# EAGLE design MotorController (EAGLE 5.10)

## Sheet 1 of 3
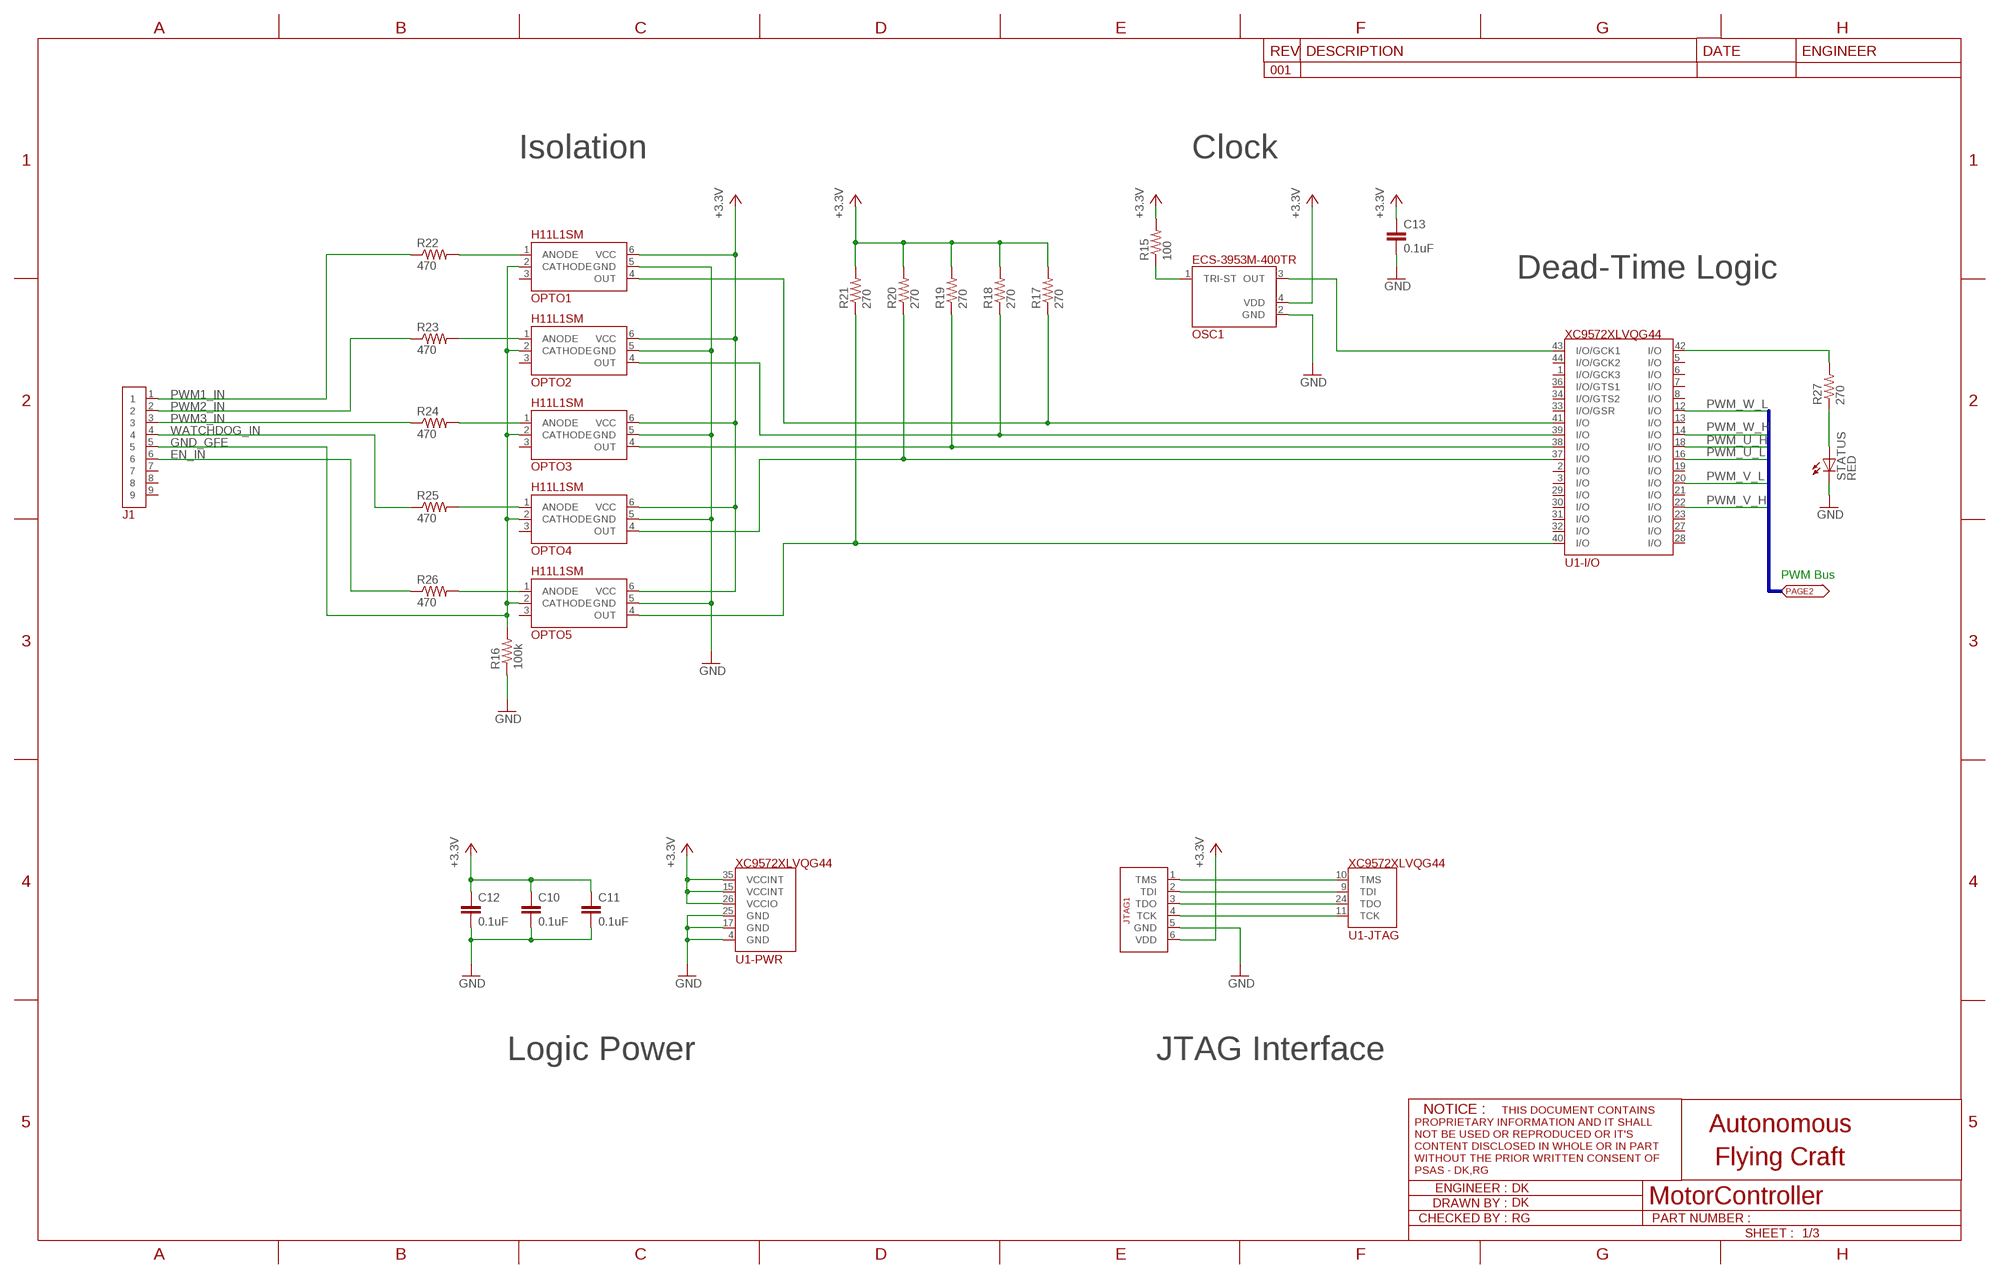
[diagram p0: schematic, sheet 1]

### Parts
C10  0.1uF  C-EUC0603  [C0603]
C11  0.1uF  C-EUC0603  [C0603]
C12  0.1uF  C-EUC0603  [C0603]
C13  0.1uF  C-EUC0603  [C0603]
J1  190-009-263-R001190  [190]
JTAG1  JTAG-FPGASMT  [HEADER6-SMT]
OPTO1  H11L1SM  [DIL6-SMD]
OPTO2  H11L1SM  [DIL6-SMD]
OPTO3  H11L1SM  [DIL6-SMD]
OPTO4  H11L1SM  [DIL6-SMD]
OPTO5  H11L1SM  [DIL6-SMD]
OSC1  ECS-3953M-400TR  [4-SMD]
R15  100  R-US_R0805  [R0805]
R16  100k  R-US_R0805  [R0805]
R17  270  R-US_R0805  [R0805]
R18  270  R-US_R0805  [R0805]
R19  270  R-US_R0805  [R0805]
R20  270  R-US_R0805  [R0805]
R21  270  R-US_R0805  [R0805]
R22  470  R-US_R0402  [R0402]
R23  470  R-US_R0402  [R0402]
R24  470  R-US_R0402  [R0402]
R25  470  R-US_R0402  [R0402]
R26  470  R-US_R0402  [R0402]
R27  270  R-US_R0805  [R0805]
STATUS  RED  LEDSMT1206  [1206]
U1  XC9572XLVQG44  [VQFP44]

### Nets
+3.3V: C10.1 C11.1 C12.1 C13.1 JTAG1.6(VDD) OPTO1.6(VCC) OPTO2.6(VCC) OPTO3.6(VCC) OPTO4.6(VCC) OPTO5.6(VCC) OSC1.4(VDD) R15.2 R17.2 R18.2 R19.2 R20.2 R21.2 U1.15(-PWR:VCCINT) U1.26(-PWR:VCCIO) U1.35(-PWR:VCCINT) ; also sheet 3
EN_IN: J1.6 R26.1
ENABLE: OPTO5.4(OUT) R21.1 U1.40(-I/O:I/O)
GND: C10.2 C11.2 C12.2 C13.2 JTAG1.5(GND) OPTO1.5(GND) OPTO2.5(GND) OPTO3.5(GND) OPTO4.5(GND) OPTO5.5(GND) OSC1.2(GND) R16.1 STATUS.C U1.4(-PWR:GND) U1.17(-PWR:GND) U1.25(-PWR:GND) ; also sheet 2,3
GND_GFE: J1.5 OPTO1.2(CATHODE) OPTO2.2(CATHODE) OPTO3.2(CATHODE) OPTO4.2(CATHODE) OPTO5.2(CATHODE) R16.2
N$6: JTAG1.1(TMS) U1.10(-JTAG:TMS)
N$12: OPTO1.1(ANODE) R22.2
N$23: OPTO2.1(ANODE) R23.2
N$44: OPTO3.1(ANODE) R24.2
N$45: OPTO4.1(ANODE) R25.2
N$48: OPTO5.1(ANODE) R26.2
N$49: R27.1 STATUS.A
N$50: R27.2 U1.42(-I/O:I/O)
N$59: JTAG1.2(TDI) U1.9(-JTAG:TDI)
N$60: JTAG1.3(TDO) U1.24(-JTAG:TDO)
N$61: JTAG1.4(TCK) U1.11(-JTAG:TCK)
N$65: OSC1.1(TRI-ST) R15.1
N$72: OSC1.3(OUT) U1.43(-I/O:I/O/GCK1)
PWM1_IN: J1.1 R22.1
PWM2_IN: J1.2 R23.1
PWM3_IN: J1.3 R24.1
PWM_U_H: U1.18(-I/O:I/O) ; also sheet 2
PWM_U_L: U1.16(-I/O:I/O) ; also sheet 2
PWM_V_H: U1.22(-I/O:I/O) ; also sheet 2
PWM_V_L: U1.20(-I/O:I/O) ; also sheet 2
PWM_W_H: U1.14(-I/O:I/O) ; also sheet 2
PWM_W_L: U1.12(-I/O:I/O) ; also sheet 2
SW1_INPUT: OPTO1.4(OUT) R17.1 U1.41(-I/O:I/O)
SW2_INPUT: OPTO2.4(OUT) R18.1 U1.39(-I/O:I/O)
SW3_INPUT: OPTO3.4(OUT) R19.1 U1.38(-I/O:I/O)
WATCHDOG: OPTO4.4(OUT) R20.1 U1.37(-I/O:I/O)
WATCHDOG_IN: J1.4 R25.1
Unconnected: J1.7 J1.8 J1.9 OPTO1.3 OPTO2.3 OPTO3.3 OPTO4.3 OPTO5.3 U1.1(-I/O:I/O/GCK3) U1.2(-I/O:I/O) U1.3(-I/O:I/O) U1.5(-I/O:I/O) U1.6(-I/O:I/O) U1.7(-I/O:I/O) U1.8(-I/O:I/O) U1.13(-I/O:I/O) U1.19(-I/O:I/O) U1.21(-I/O:I/O) U1.23(-I/O:I/O) U1.27(-I/O:I/O) U1.28(-I/O:I/O) U1.29(-I/O:I/O) U1.30(-I/O:I/O) U1.31(-I/O:I/O) U1.32(-I/O:I/O) U1.33(-I/O:I/O/GSR) U1.34(-I/O:I/O/GTS2) U1.36(-I/O:I/O/GTS1) U1.44(-I/O:I/O/GCK2)

### Buses
PWM:PWM0_[1..6],PWM1_[1..6]

### Notes on the sheet
- Isolation | Clock
- Dead-Time Logic
- PWM Bus
- Logic Power | JTAG Interface

## Sheet 2 of 3
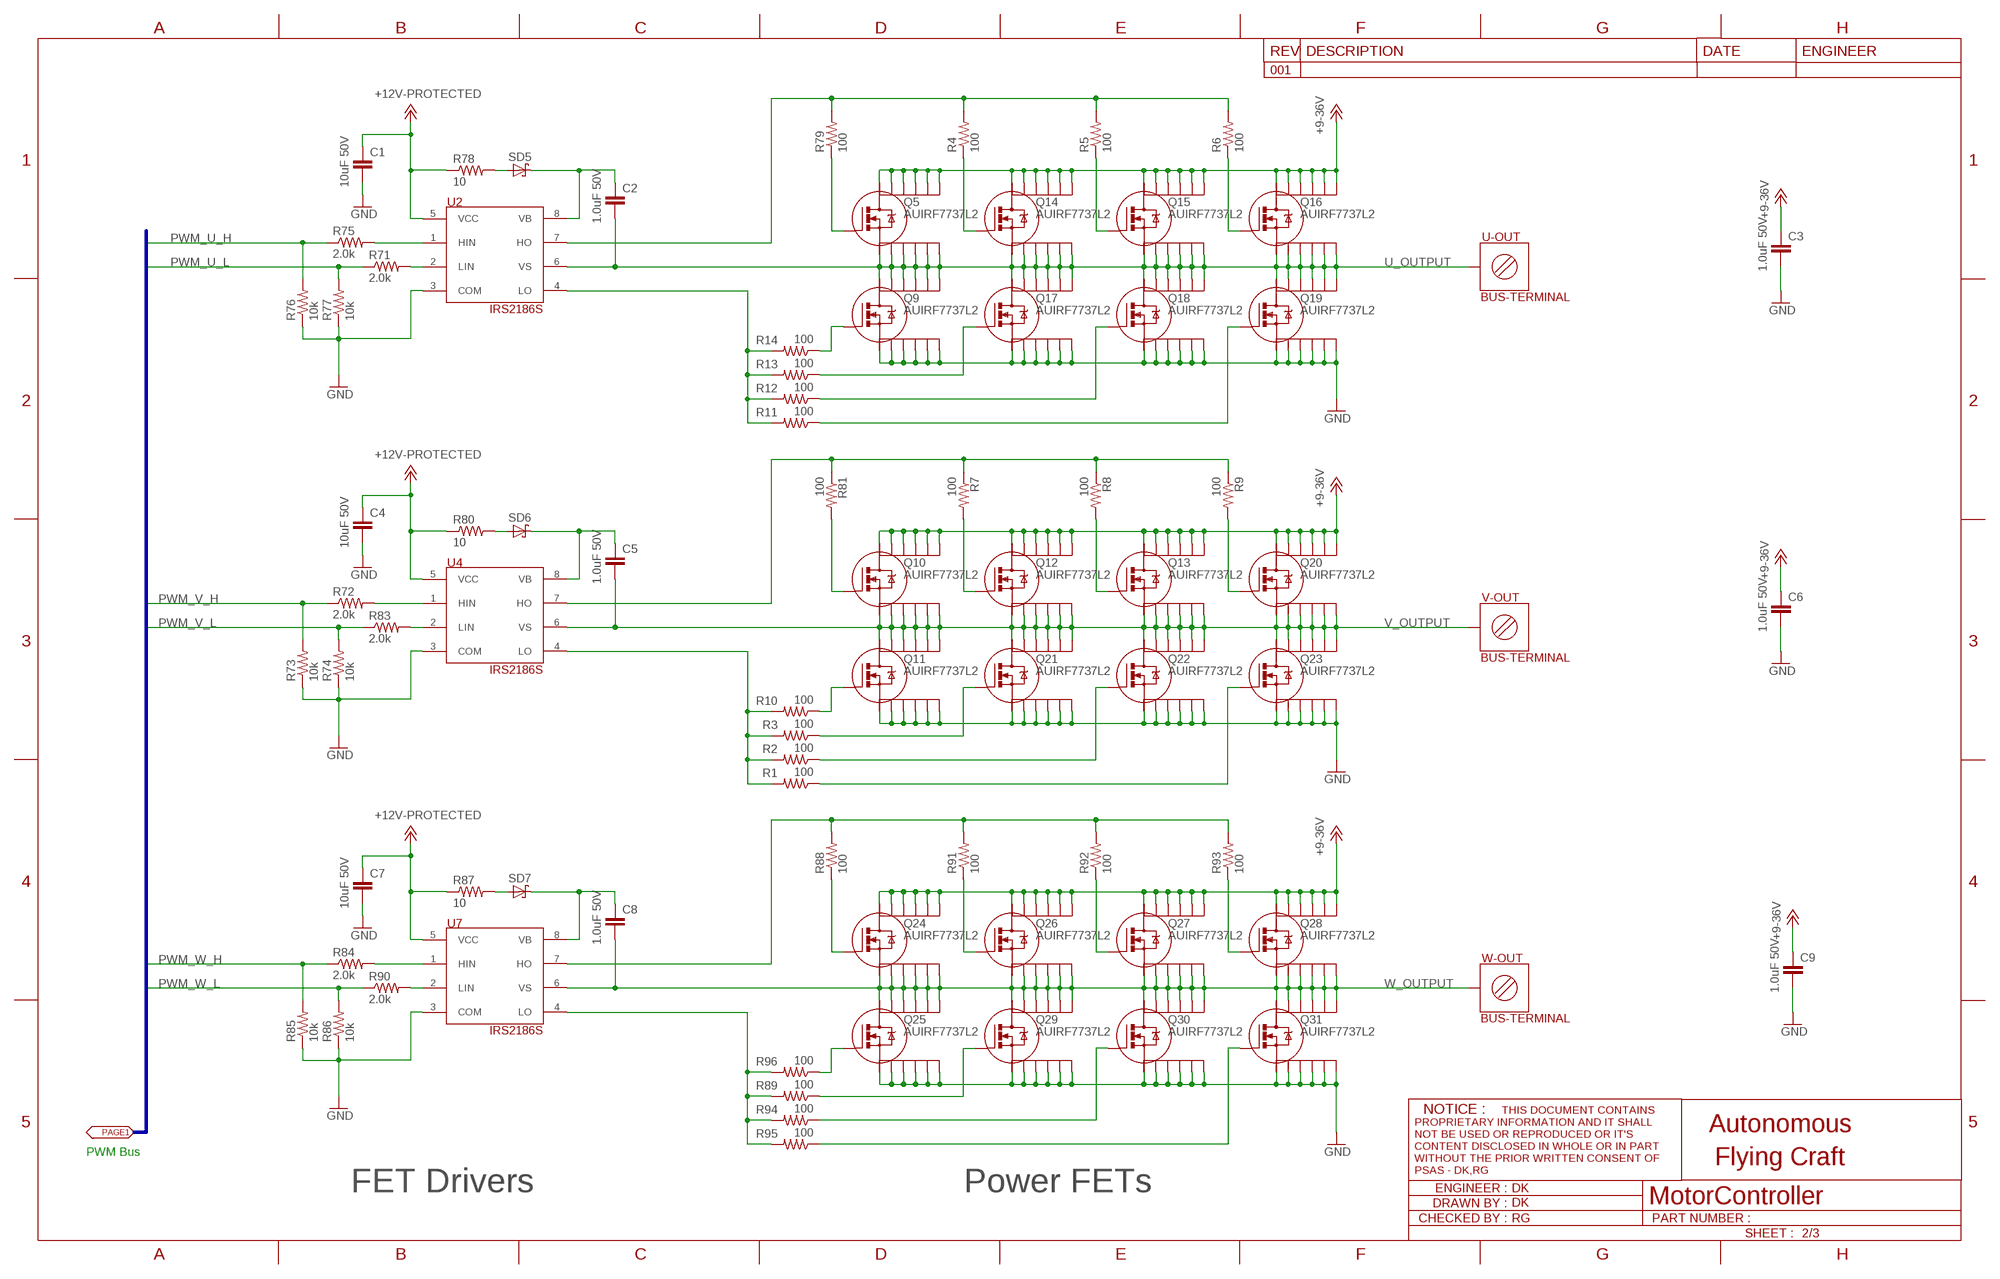
[diagram p1: schematic, sheet 2]

### Parts
C1  10uF 50V  C-EUC1210  [C1210]
C2  1.0uF 50V  C-EUC1210  [C1210]
C3  1.0uF 50V  C-EUC1210  [C1210]
C4  10uF 50V  C-EUC1210  [C1210]
C5  1.0uF 50V  C-EUC1210  [C1210]
C6  1.0uF 50V  C-EUC1210  [C1210]
C7  10uF 50V  C-EUC1210  [C1210]
C8  1.0uF 50V  C-EUC1210  [C1210]
C9  1.0uF 50V  C-EUC1210  [C1210]
Q5  AUIRF7737L2  [DIRECT_FET_L6]
Q9  AUIRF7737L2  [DIRECT_FET_L6]
Q10  AUIRF7737L2  [DIRECT_FET_L6]
Q11  AUIRF7737L2  [DIRECT_FET_L6]
Q12  AUIRF7737L2  [DIRECT_FET_L6]
Q13  AUIRF7737L2  [DIRECT_FET_L6]
Q14  AUIRF7737L2  [DIRECT_FET_L6]
Q15  AUIRF7737L2  [DIRECT_FET_L6]
Q16  AUIRF7737L2  [DIRECT_FET_L6]
Q17  AUIRF7737L2  [DIRECT_FET_L6]
Q18  AUIRF7737L2  [DIRECT_FET_L6]
Q19  AUIRF7737L2  [DIRECT_FET_L6]
Q20  AUIRF7737L2  [DIRECT_FET_L6]
Q21  AUIRF7737L2  [DIRECT_FET_L6]
Q22  AUIRF7737L2  [DIRECT_FET_L6]
Q23  AUIRF7737L2  [DIRECT_FET_L6]
Q24  AUIRF7737L2  [DIRECT_FET_L6]
Q25  AUIRF7737L2  [DIRECT_FET_L6]
Q26  AUIRF7737L2  [DIRECT_FET_L6]
Q27  AUIRF7737L2  [DIRECT_FET_L6]
Q28  AUIRF7737L2  [DIRECT_FET_L6]
Q29  AUIRF7737L2  [DIRECT_FET_L6]
Q30  AUIRF7737L2  [DIRECT_FET_L6]
Q31  AUIRF7737L2  [DIRECT_FET_L6]
R1  100  R-US_R0805  [R0805]
R2  100  R-US_R0805  [R0805]
R3  100  R-US_R0805  [R0805]
R4  100  R-US_R0805  [R0805]
R5  100  R-US_R0805  [R0805]
R6  100  R-US_R0805  [R0805]
R7  100  R-US_R0805  [R0805]
R8  100  R-US_R0805  [R0805]
R9  100  R-US_R0805  [R0805]
R10  100  R-US_R0805  [R0805]
R11  100  R-US_R0805  [R0805]
R12  100  R-US_R0805  [R0805]
R13  100  R-US_R0805  [R0805]
R14  100  R-US_R0805  [R0805]
R71  2.0k  R-US_R0805  [R0805]
R72  2.0k  R-US_R0805  [R0805]
R73  10k  R-US_R0805  [R0805]
R74  10k  R-US_R0805  [R0805]
R75  2.0k  R-US_R0805  [R0805]
R76  10k  R-US_R0805  [R0805]
R77  10k  R-US_R0805  [R0805]
R78  10  R-US_R0805  [R0805]
R79  100  R-US_R0805  [R0805]
R80  10  R-US_R0805  [R0805]
R81  100  R-US_R0805  [R0805]
R83  2.0k  R-US_R0805  [R0805]
R84  2.0k  R-US_R0805  [R0805]
R85  10k  R-US_R0805  [R0805]
R86  10k  R-US_R0805  [R0805]
R87  10  R-US_R0805  [R0805]
R88  100  R-US_R0805  [R0805]
R89  100  R-US_R0805  [R0805]
R90  2.0k  R-US_R0805  [R0805]
R91  100  R-US_R0805  [R0805]
R92  100  R-US_R0805  [R0805]
R93  100  R-US_R0805  [R0805]
R94  100  R-US_R0805  [R0805]
R95  100  R-US_R0805  [R0805]
R96  100  R-US_R0805  [R0805]
SD5  MBRS1100T3  [SMB]
SD6  MBRS1100T3  [SMB]
SD7  MBRS1100T3  [SMB]
U2  IRS2186S  [SOIC-8]
U4  IRS2186S  [SOIC-8]
U7  IRS2186S  [SOIC-8]
U-OUT  BUS-TERMINAL  [BUS-TERMINAL-LAYOUT]
V-OUT  BUS-TERMINAL  [BUS-TERMINAL-LAYOUT]
W-OUT  BUS-TERMINAL  [BUS-TERMINAL-LAYOUT]

### Nets
+9-36V: C3.1 C6.1 C9.1 Q5.D1(D) Q5.D2(D) Q5.D3(D) Q5.D4(D) Q5.D5(D) Q5.D6(D) Q10.D1(D) Q10.D2(D) Q10.D3(D) Q10.D4(D) Q10.D5(D) Q10.D6(D) Q12.D1(D) Q12.D2(D) Q12.D3(D) Q12.D4(D) Q12.D5(D) Q12.D6(D) Q13.D1(D) Q13.D2(D) Q13.D3(D) Q13.D4(D) Q13.D5(D) Q13.D6(D) Q14.D1(D) Q14.D2(D) Q14.D3(D) Q14.D4(D) Q14.D5(D) Q14.D6(D) Q15.D1(D) Q15.D2(D) Q15.D3(D) Q15.D4(D) Q15.D5(D) Q15.D6(D) Q16.D1(D) Q16.D2(D) Q16.D3(D) Q16.D4(D) Q16.D5(D) Q16.D6(D) Q20.D1(D) Q20.D2(D) Q20.D3(D) Q20.D4(D) Q20.D5(D) Q20.D6(D) Q24.D1(D) Q24.D2(D) Q24.D3(D) Q24.D4(D) Q24.D5(D) Q24.D6(D) Q26.D1(D) Q26.D2(D) Q26.D3(D) Q26.D4(D) Q26.D5(D) Q26.D6(D) Q27.D1(D) Q27.D2(D) Q27.D3(D) Q27.D4(D) Q27.D5(D) Q27.D6(D) Q28.D1(D) Q28.D2(D) Q28.D3(D) Q28.D4(D) Q28.D5(D) Q28.D6(D) ; also sheet 3
+12V-PROTECTED: C1.1 C4.1 C7.1 R78.1 R80.1 R87.1 U2.5(VCC) U4.5(VCC) U7.5(VCC) ; also sheet 3
GND: C1.2 C3.2 C4.2 C6.2 C7.2 C9.2 Q9.S1(S) Q9.S2(S) Q9.S3(S) Q9.S4(S) Q9.S5(S) Q9.S6(S) Q11.S1(S) Q11.S2(S) Q11.S3(S) Q11.S4(S) Q11.S5(S) Q11.S6(S) Q17.S1(S) Q17.S2(S) Q17.S3(S) Q17.S4(S) Q17.S5(S) Q17.S6(S) Q18.S1(S) Q18.S2(S) Q18.S3(S) Q18.S4(S) Q18.S5(S) Q18.S6(S) Q19.S1(S) Q19.S2(S) Q19.S3(S) Q19.S4(S) Q19.S5(S) Q19.S6(S) Q21.S1(S) Q21.S2(S) Q21.S3(S) Q21.S4(S) Q21.S5(S) Q21.S6(S) Q22.S1(S) Q22.S2(S) Q22.S3(S) Q22.S4(S) Q22.S5(S) Q22.S6(S) Q23.S1(S) Q23.S2(S) Q23.S3(S) Q23.S4(S) Q23.S5(S) Q23.S6(S) Q25.S1(S) Q25.S2(S) Q25.S3(S) Q25.S4(S) Q25.S5(S) Q25.S6(S) Q29.S1(S) Q29.S2(S) Q29.S3(S) Q29.S4(S) Q29.S5(S) Q29.S6(S) Q30.S1(S) Q30.S2(S) Q30.S3(S) Q30.S4(S) Q30.S5(S) Q30.S6(S) Q31.S1(S) Q31.S2(S) Q31.S3(S) Q31.S4(S) Q31.S5(S) Q31.S6(S) R73.1 R74.1 R76.1 R77.1 R85.1 R86.1 U2.3(COM) U4.3(COM) U7.3(COM) ; also sheet 1,3
N$1: Q9.G R14.1
N$2: Q17.G R13.1
N$3: Q18.G R12.1
N$4: R83.2 U4.2(LIN)
N$5: Q19.G R11.1
N$7: Q5.G R79.1
N$8: Q10.G R81.2
N$9: R71.2 U2.2(LIN)
N$10: Q11.G R10.1
N$11: Q12.G R7.2
N$13: Q26.G R91.1
N$14: C2.1 SD5.C U2.8(VB)
N$15: Q13.G R8.2
N$16: Q27.G R92.1
N$17: R78.2 SD5.A
N$18: R75.2 U2.1(HIN)
N$19: R11.2 R12.2 R13.2 R14.2 U2.4(LO)
N$20: Q28.G R93.1
N$21: Q24.G R88.1
N$22: C5.1 SD6.C U4.8(VB)
N$24: Q20.G R9.2
N$25: R80.2 SD6.A
N$26: R72.2 U4.1(HIN)
N$27: R1.2 R2.2 R3.2 R10.2 U4.4(LO)
N$28: Q25.G R96.1
N$29: R90.2 U7.2(LIN)
N$30: Q29.G R89.1
N$31: C8.1 SD7.C U7.8(VB)
N$32: R88.2 R91.2 R92.2 R93.2 U7.7(HO)
N$33: Q30.G R94.1
N$34: R87.2 SD7.A
N$35: R84.2 U7.1(HIN)
N$36: R89.2 R94.2 R95.2 R96.2 U7.4(LO)
N$37: Q31.G R95.1
N$38: Q21.G R3.1
N$39: Q22.G R2.1
N$40: Q23.G R1.1
N$41: Q14.G R4.1
N$42: Q15.G R5.1
N$43: Q16.G R6.1
N$46: R7.1 R8.1 R9.1 R81.1 U4.7(HO)
N$47: R4.2 R5.2 R6.2 R79.2 U2.7(HO)
PWM_U_H: R75.1 R76.2 ; also sheet 1
PWM_U_L: R71.1 R77.2 ; also sheet 1
PWM_V_H: R72.1 R73.2 ; also sheet 1
PWM_V_L: R74.2 R83.1 ; also sheet 1
PWM_W_H: R84.1 R85.2 ; also sheet 1
PWM_W_L: R86.2 R90.1 ; also sheet 1
U_OUTPUT: C2.2 Q5.S1(S) Q5.S2(S) Q5.S3(S) Q5.S4(S) Q5.S5(S) Q5.S6(S) Q9.D1(D) Q9.D2(D) Q9.D3(D) Q9.D4(D) Q9.D5(D) Q9.D6(D) Q14.S1(S) Q14.S2(S) Q14.S3(S) Q14.S4(S) Q14.S5(S) Q14.S6(S) Q15.S1(S) Q15.S2(S) Q15.S3(S) Q15.S4(S) Q15.S5(S) Q15.S6(S) Q16.S1(S) Q16.S2(S) Q16.S3(S) Q16.S4(S) Q16.S5(S) Q16.S6(S) Q17.D1(D) Q17.D2(D) Q17.D3(D) Q17.D4(D) Q17.D5(D) Q17.D6(D) Q18.D1(D) Q18.D2(D) Q18.D3(D) Q18.D4(D) Q18.D5(D) Q18.D6(D) Q19.D1(D) Q19.D2(D) Q19.D3(D) Q19.D4(D) Q19.D5(D) Q19.D6(D) U2.6(VS) U-OUT.1
V_OUTPUT: C5.2 Q10.S1(S) Q10.S2(S) Q10.S3(S) Q10.S4(S) Q10.S5(S) Q10.S6(S) Q11.D1(D) Q11.D2(D) Q11.D3(D) Q11.D4(D) Q11.D5(D) Q11.D6(D) Q12.S1(S) Q12.S2(S) Q12.S3(S) Q12.S4(S) Q12.S5(S) Q12.S6(S) Q13.S1(S) Q13.S2(S) Q13.S3(S) Q13.S4(S) Q13.S5(S) Q13.S6(S) Q20.S1(S) Q20.S2(S) Q20.S3(S) Q20.S4(S) Q20.S5(S) Q20.S6(S) Q21.D1(D) Q21.D2(D) Q21.D3(D) Q21.D4(D) Q21.D5(D) Q21.D6(D) Q22.D1(D) Q22.D2(D) Q22.D3(D) Q22.D4(D) Q22.D5(D) Q22.D6(D) Q23.D1(D) Q23.D2(D) Q23.D3(D) Q23.D4(D) Q23.D5(D) Q23.D6(D) U4.6(VS) V-OUT.1
W_OUTPUT: C8.2 Q24.S1(S) Q24.S2(S) Q24.S3(S) Q24.S4(S) Q24.S5(S) Q24.S6(S) Q25.D1(D) Q25.D2(D) Q25.D3(D) Q25.D4(D) Q25.D5(D) Q25.D6(D) Q26.S1(S) Q26.S2(S) Q26.S3(S) Q26.S4(S) Q26.S5(S) Q26.S6(S) Q27.S1(S) Q27.S2(S) Q27.S3(S) Q27.S4(S) Q27.S5(S) Q27.S6(S) Q28.S1(S) Q28.S2(S) Q28.S3(S) Q28.S4(S) Q28.S5(S) Q28.S6(S) Q29.D1(D) Q29.D2(D) Q29.D3(D) Q29.D4(D) Q29.D5(D) Q29.D6(D) Q30.D1(D) Q30.D2(D) Q30.D3(D) Q30.D4(D) Q30.D5(D) Q30.D6(D) Q31.D1(D) Q31.D2(D) Q31.D3(D) Q31.D4(D) Q31.D5(D) Q31.D6(D) U7.6(VS) W-OUT.1

### Buses
PWM:PWM0_[1..6],PWM1_[1..6]

### Notes on the sheet
- PWM Bus
- FET Drivers | Power FETs

## Sheet 3 of 3
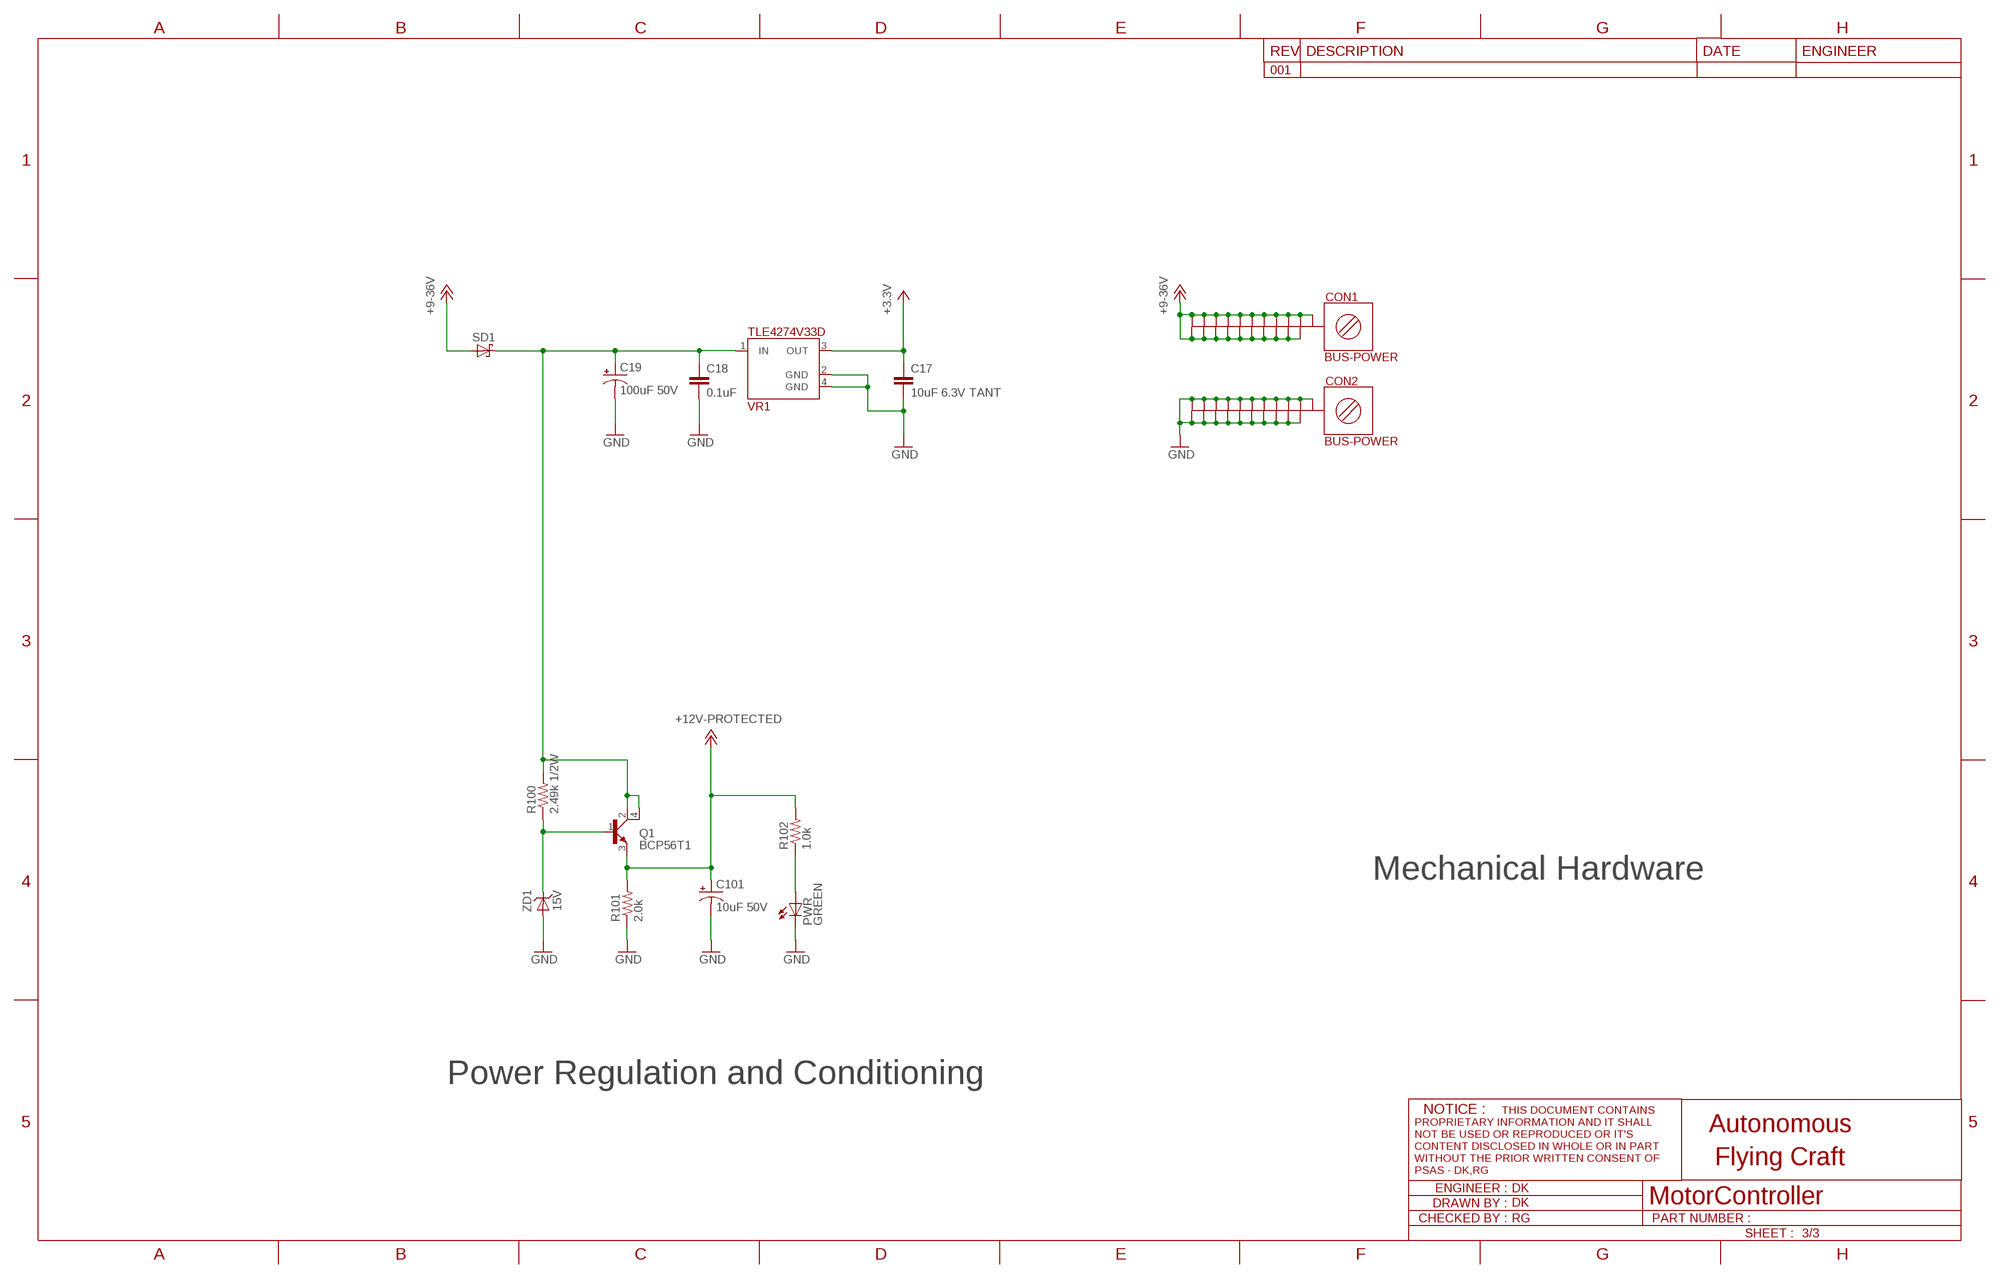
[diagram p2: schematic, sheet 3]

### Parts
C17  10uF 6.3V TANT  C-EUC1206  [C1206]
C18  0.1uF  C-EUC0603  [C0603]
C19  100uF 50V  CAPACITOR-POLPANASONIC_F  [PANASONIC_F]
C101  10uF 50V  CPOL-USD  [PANASONIC_D]
CON1  BUS-POWER  [BUS-LAYOUT]
CON2  BUS-POWER  [BUS-LAYOUT]
PWR  GREEN  LEDSMT1206  [1206]
Q1  BCP56T1  [SOT223]
R100  2.49k 1/2W  R-US_R1210  [R1210]
R101  2.0k  R-US_R0805  [R0805]
R102  1.0k  R-US_R0805  [R0805]
SD1  MBRS360T3  [SMC]
VR1  TLE4274V33D  [PG-TO252-3-11]
ZD1  15V  1SMA5929BT3G  [SMA]

### Nets
+3.3V: C17.1 VR1.3(OUT) ; also sheet 1
+9-36V: CON1.1 CON1.2 CON1.3 CON1.4 CON1.5 CON1.6 CON1.7 CON1.8 CON1.9 CON1.10 CON1.11 CON1.12 CON1.13 CON1.14 CON1.15 CON1.16 CON1.17 CON1.18 CON1.19 CON1.20 CON1.21 SD1.A ; also sheet 2
+12V-PROTECTED: C101.+ Q1.3(E) R101.2 R102.2 ; also sheet 2
GND: C17.2 C18.2 C19.- C101.- CON2.1 CON2.2 CON2.3 CON2.4 CON2.5 CON2.6 CON2.7 CON2.8 CON2.9 CON2.10 CON2.11 CON2.12 CON2.13 CON2.14 CON2.15 CON2.16 CON2.17 CON2.18 CON2.19 CON2.20 CON2.21 PWR.C R101.1 VR1.2(GND) VR1.4(GND) ZD1.A ; also sheet 1,2
N$62: Q1.1(B) R100.1 ZD1.C
N$63: PWR.A R102.1
N$100: C18.1 C19.+ Q1.2(C) Q1.4(C) R100.2 SD1.C VR1.1(IN)

### Notes on the sheet
- Mechanical Hardware
- Power Regulation and Conditioning

## Library data of the parts
C1-C13 C17 C18 = motorController:C-EU: CAPACITOR, European symbol
C19 = motorController:CAPACITOR-POL
C101 = motorController:CPOL-US: POLARIZED CAPACITOR, American symbol
CON1 CON2 = motorController:BUS-POWER
J1 = motorController:190-009-263-R001
JTAG1 = motorController:JTAG-FPGA: Digikey 3M9488CT-ND
OPTO1-OPTO5 = motorController:H11L1S
OSC1 = motorController:ECS-3953M-400
PWR STATUS = motorController:LED: LED OSRAM: - CHIPLED LG R971, LG N971, LY N971, LG Q971, LY Q971, LO R971, LY R971 LH N974, LH R974 LS Q976, LO Q976, LY Q976 LO Q996 - Hyper CHIPLED LW Q18S LB Q993, LB Q99A, LB R99A - SideLED LS A670, LO A670, LY A670, LG A670, LP A670 LB A673, LV A673, LT A673, LW A673 LH A674 LY A675 LS A676, LA A676, LO A676, LY A676, LW A676 LS A679, LY A679, LG A679 - Hyper Micro SIDELED® LS Y876, LA Y876, LO Y876, LY Y876 LT Y87S - SmartLED LW L88C, LW L88S LB L89C, LB L89S, LG L890 LS L89K, LO L89K, LY L89K LS L896, LA L896, LO L896, LY L896 - TOPLED LS T670, LO T670, LY T670, LG T670, LP T670 LSG T670, LSP T670, LSY T670, LOP T670, LYG T670 LG T671, LOG T671, LSG T671 LB T673, LV T673, LT T673, LW T673 LH T674 LS T676, LA T676, LO T676, LY T676, LB T676, LH T676, LSB T676, LW T676 LB T67C, LV T67C, LT T67C, LS T67K, LO T67K, LY T67K, LW E67C LS E67B, LA E67B, LO E67B, LY E67B, LB E67C, LV E67C, LT E67C LW T67C LS T679, LY T679, LG T679 LS T770, LO T770, LY T770, LG T770, LP T770 LB T773, LV T773, LT T773, LW T773 LH T774 LS E675, LA E675, LY E675, LS T675 LS T776, LA T776, LO T776, LY T776, LB T776 LHGB T686 LT T68C, LB T68C - Hyper Mini TOPLED® LB M676 - Mini TOPLED Santana® LG M470 LS M47K, LO M47K, LY M47K Source: http://www.osram.convergy.de/
Q1 = motorController:BCP56T1
Q5 Q9-Q31 = motorController:AUIRF7737L2: N channel MOSFET from IRF
R1-R27 R71-R81 R83-R96 R100-R102 = motorController:R-US_: RESISTOR, American symbol
SD1 = motorController:MBRS360T3
SD5-SD7 = motorController:MBRS1100T3
U1 = motorController:XC9572XL
U2 U4 U7 = motorController:IRS2186
U-OUT V-OUT W-OUT = motorController:BUS-TERMINAL
VR1 = motorController:TLE4274V33
ZD1 = motorController:1SMA5929BT3G: Zener Diode 15V @25mA ON-Semiconductor

## Board
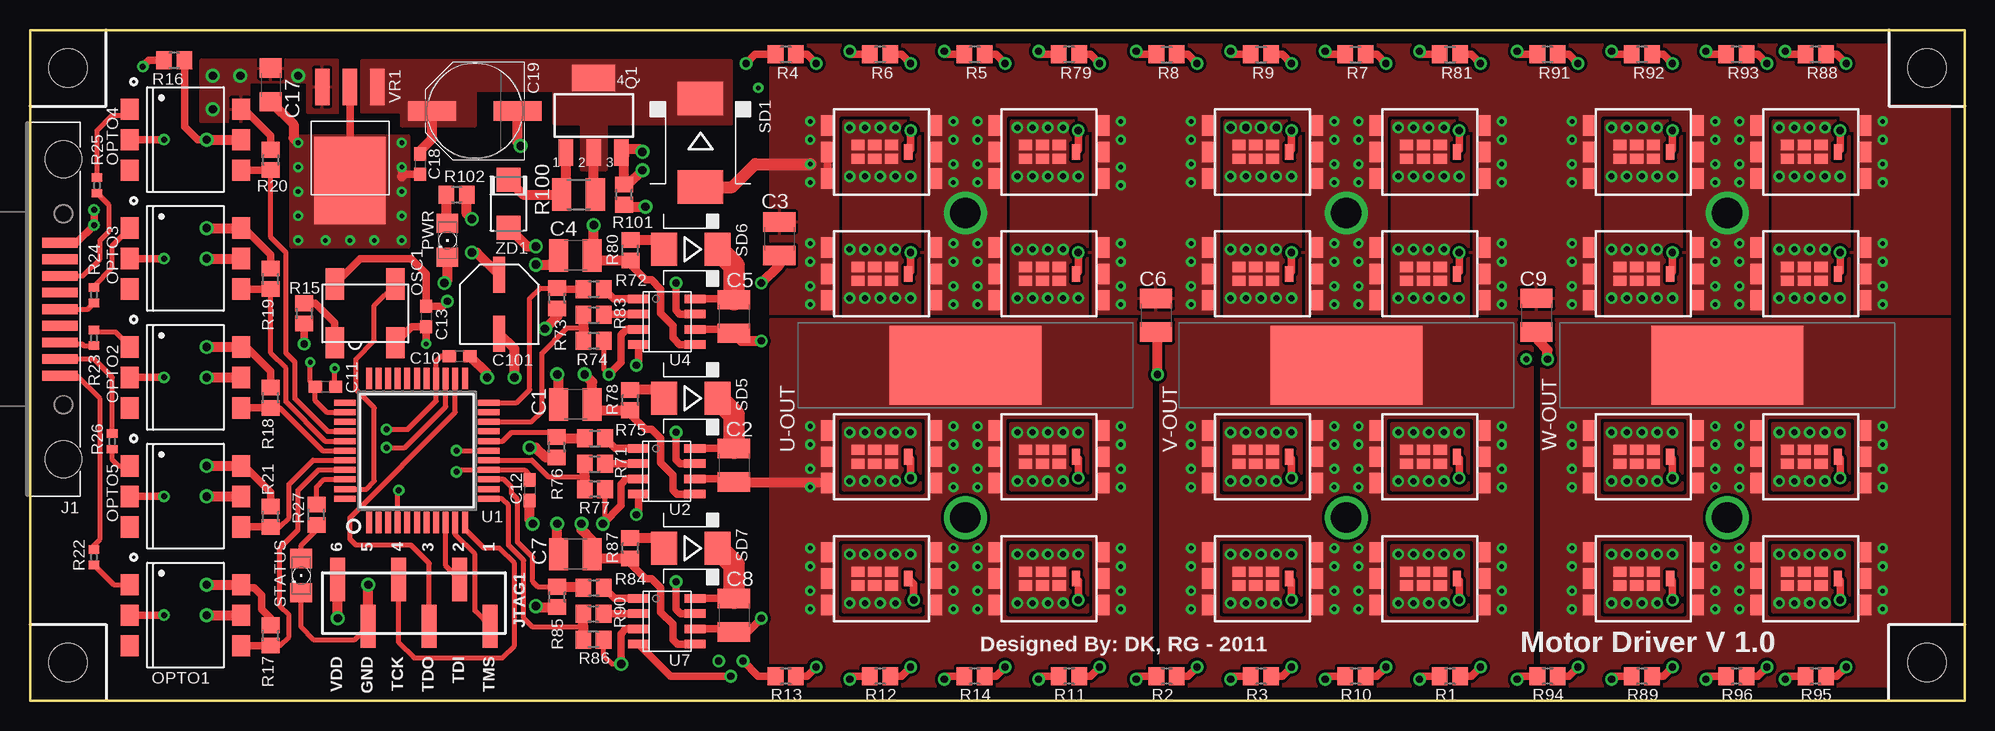
[diagram p3: board, top side]
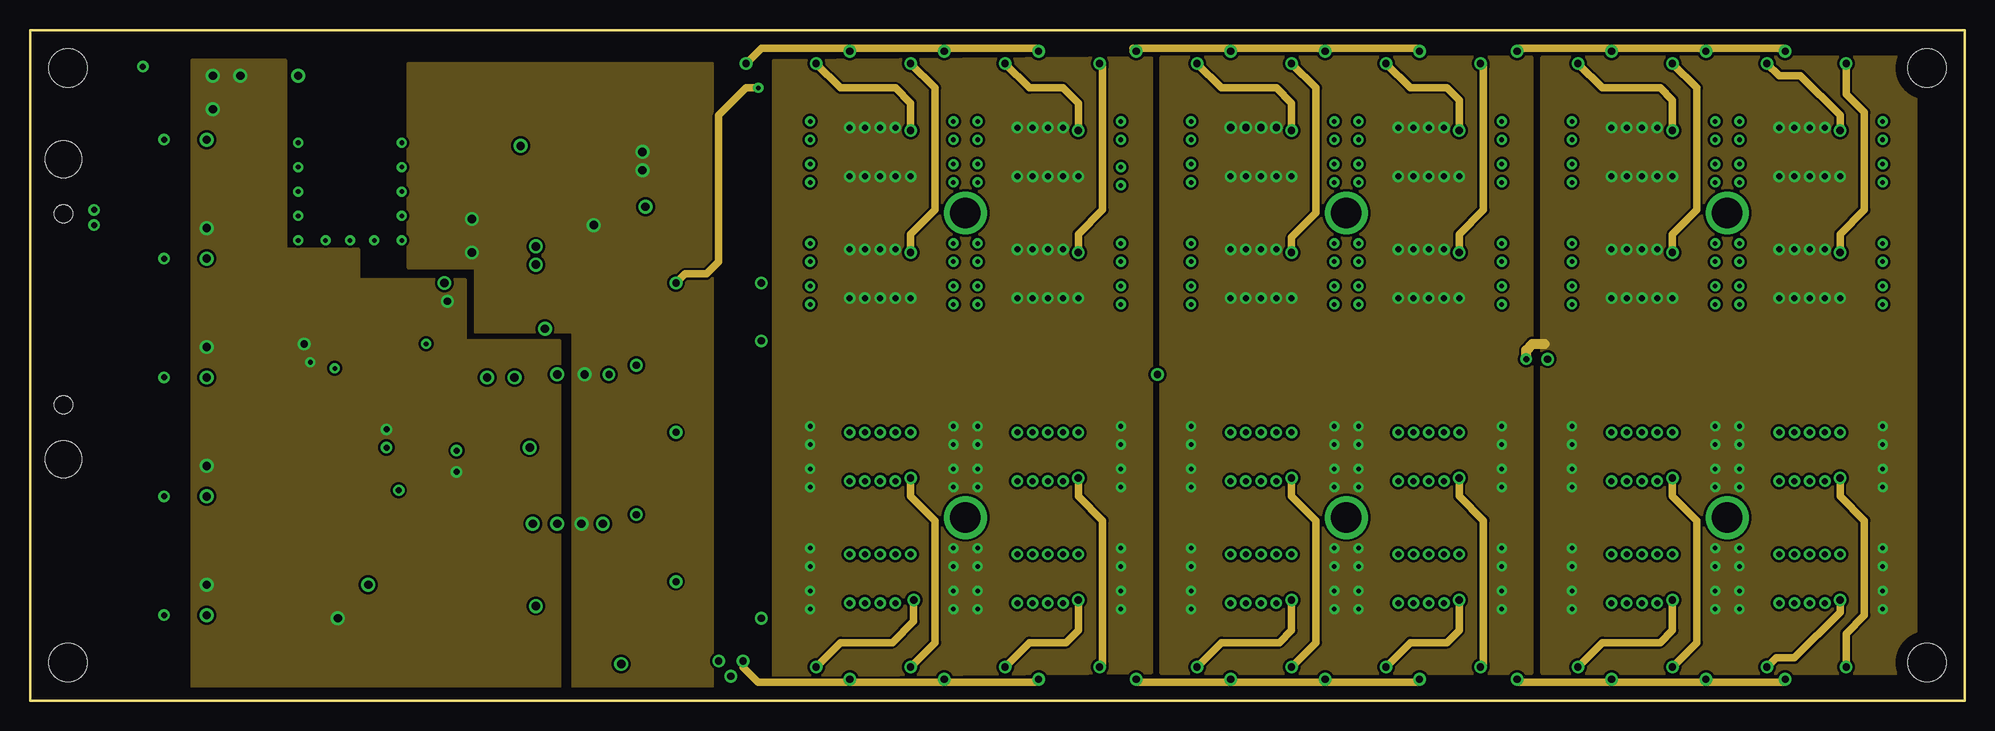
[diagram p4: board, inner layer Route2]
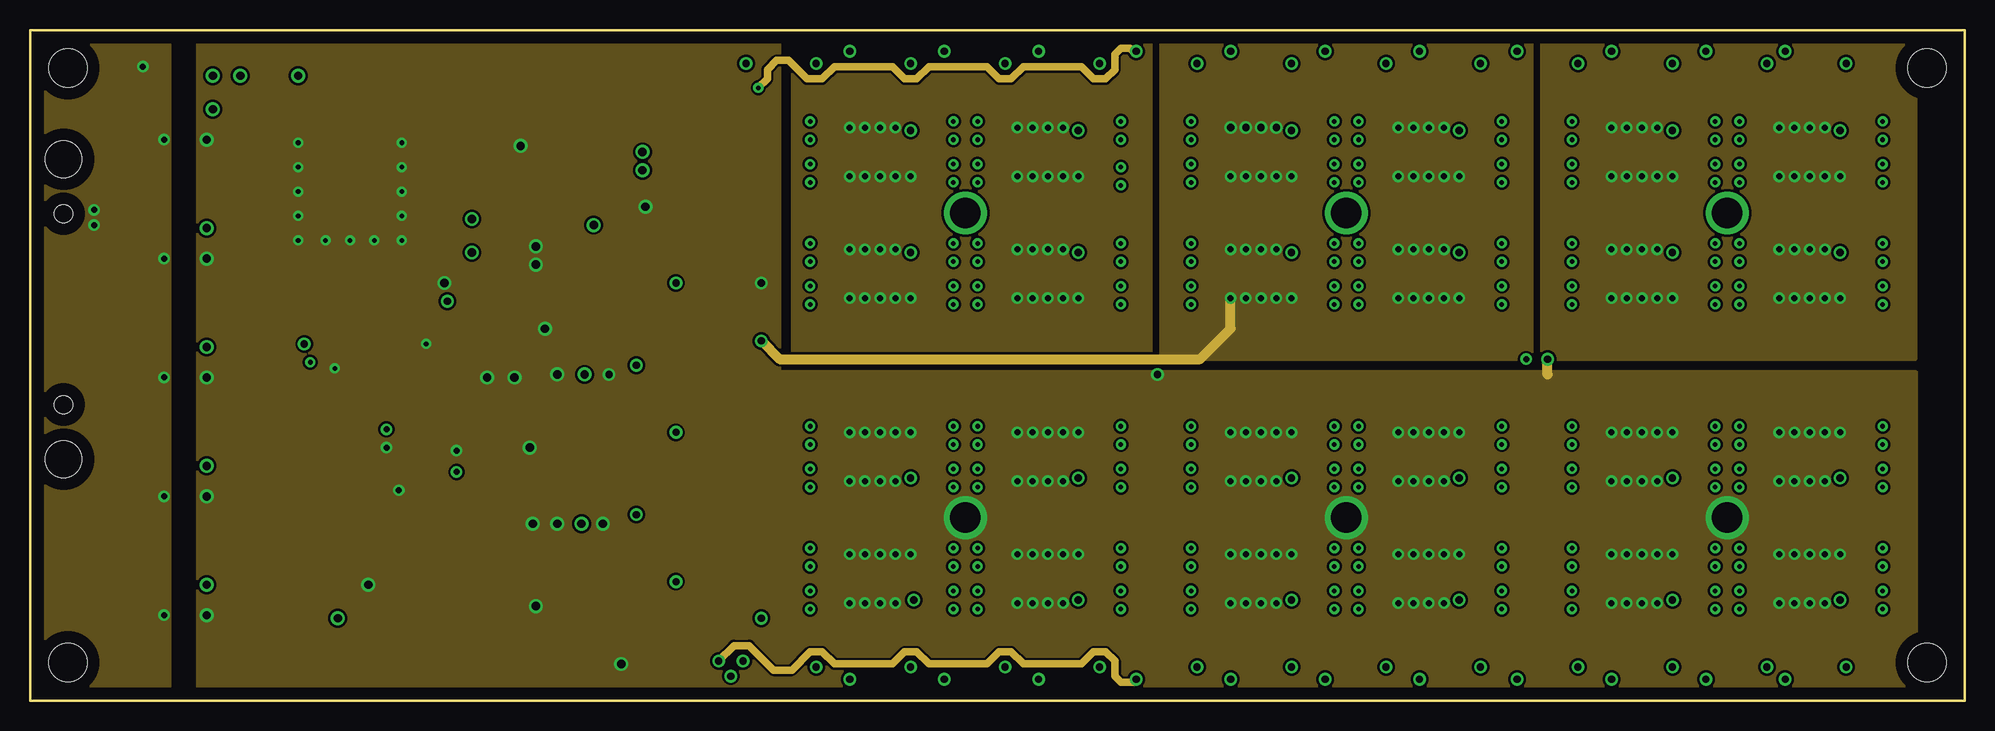
[diagram p5: board, inner layer Route3]
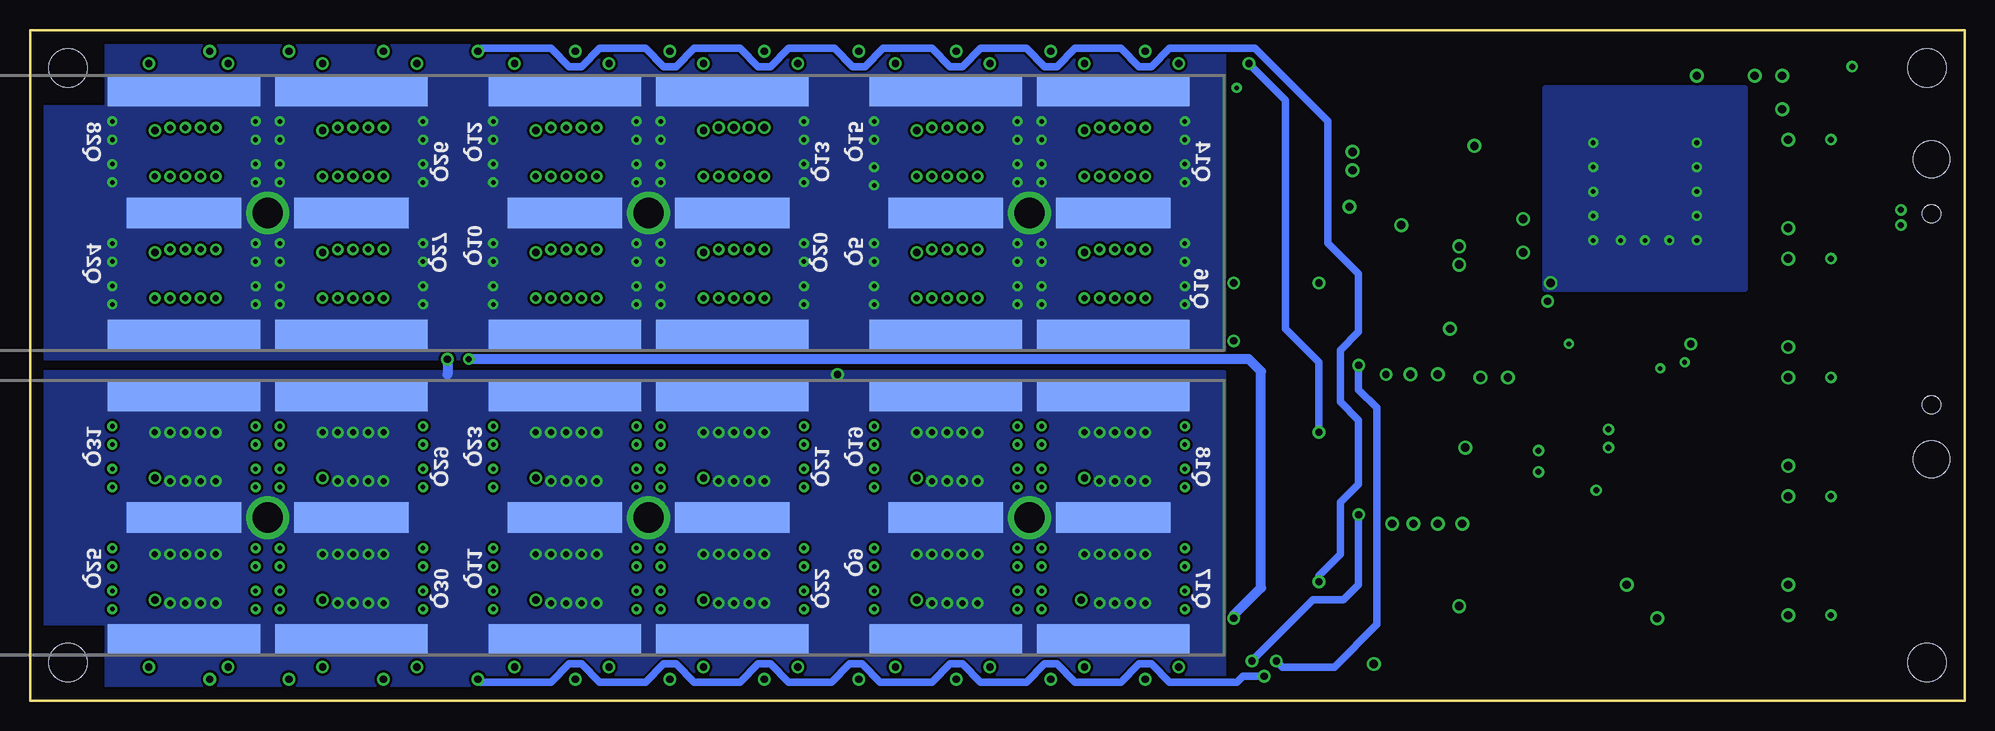
[diagram p6: board, bottom side, seen from below]

Size 161.29 x 55.88 mm. Coordinates in mm from the lower left corner, seen from the top.
Outline: 0,0 161.29,0 161.29,55.88 0,55.88 0,0
Copper layers (1*2+3*16): Top 0.035mm / dielectric 0.508mm / Route2 0.035mm / dielectric 0.5588mm / Route3 0.035mm / dielectric 0.508mm / Bottom 0.035mm
Design rules "Design Rules *": minimum track width 8mil, minimum drill 15mil, track to track 8mil, track to pad 8mil, pad to pad 8mil, via to via 9mil, smd to smd 8mil, copper to edge 40mil, drill to drill 17mil, minimum pad ring 10mil, minimum via ring 9mil, stop-mask expansion 4mil, vias tented up to drill 0mil, thermal gap 10mil
Holes 3.17 mm at 3.17,52.7 3.17,3.17 158.12,52.7 158.12,3.17

### Footprints (pad centres in the part's own frame; a part is rotated, then mirrored left to right if it is on the bottom)
C1210 = smd 1.6 x 2.7: 1 -1.4,0; 2 1.4,0
C0603 = smd 1.1 x 1: 1 -0.85,0; 2 0.85,0
C1206 = smd 1.6 x 1.8: 1 -1.4,0; 2 1.4,0
PANASONIC_F = smd 4 x 1.6: + 3.55,0; - -3.55,0
PANASONIC_D = smd 3 x 1: + 2.45,0; - -2.45,0
BUS-LAYOUT = smd 12.7 x 2.54: 1 9.271,10.16; 3 9.271,-10.16; 4 23.241,10.16; 6 23.241,-10.16; 7 41.021,10.16; 9 41.021,-10.16; 10 54.991,10.16; 12 54.991,-10.16; 13 72.771,10.16; 15 72.771,-10.16; 16 86.741,10.16; 18 86.741,-10.16 | smd 9.525 x 2.54: 2 9.271,0; 5 23.241,0; 8 41.021,0; 11 54.991,0; 14 72.771,0; 17 86.741,0 | drill 2.54 round: 19 16.256,0; 20 48.006,0; 21 79.756,0
190 = smd 0.813 x 2.972: 1 -5.537,-0.368; 2 -2.769,-0.368; 3 0,-0.368; 4 2.769,-0.368; 5 5.537,-0.368; 6 -4.153,-0.368; 7 -1.384,-0.368; 8 1.384,-0.368; 9 4.153,-0.368 | hole 1.499: -7.95,-0.66; 7.95,-0.66 | hole 3.048: -12.497,-0.66; 12.497,-0.66
HEADER6-SMT = smd 3.607 x 1.27: 1 1.93,5.08; 2 -1.956,2.54; 3 1.93,0; 4 -1.956,-2.54; 5 1.93,-5.08; 6 -1.956,-7.62
DIL6-SMD = smd 1.78 x 1.52: 1 -2.54,-4.645; 2 0,-4.645; 3 2.54,-4.645; 4 2.54,4.645; 5 0,4.645; 6 -2.54,4.645
4-SMD = smd 1.55 x 2.618: 1 -2.535,-2.438; 2 2.535,-2.438; 3 2.535,2.438; 4 -2.54,2.438
1206 = smd 1.6 x 1.803: A -1.422,0; C 1.422,0
SOT223 = smd 1.219 x 2.235: 1 -2.311,-3.099; 2 0,-3.099; 3 2.311,-3.099 | smd 3.6 x 2.2: 4 0,3.099
DIRECT_FET_L6 = smd 1.1 x 1.7: D1 -4.35,2.2; D2 -4.35,0; D3 -4.35,-2.2; D4 4.65,2.2; D5 4.65,0; D6 4.65,-2.2 | smd 0.7 x 1.3: G -2.1,0 | smd 1.1 x 0.85: S1 -0.7,0.575; S2 0.7,0.575; S3 2.1,0.575; S4 -0.7,-0.575; S5 0.7,-0.575; S6 2.1,-0.575
R0805 = smd 1.3 x 1.5: 1 -0.85,0; 2 0.85,0
R0402 = smd 0.7 x 0.9: 1 -0.65,0; 2 0.65,0
R1210 = smd 1.6 x 2.7: 1 -1.4,0; 2 1.4,0
SMC = smd 2.8 x 3.8: A 3.7,0; C -3.7,0
SMB = smd 2.159 x 2.743: A 2.261,0; C -2.184,0
VQFP44 = smd 0.5 x 1.8: 1 -4,-6; 2 -3.2,-6; 3 -2.4,-6; 4 -1.6,-6; 5 -0.8,-6; 6 0,-6; 7 0.8,-6; 8 1.6,-6; 9 2.4,-6; 10 3.2,-6; 11 4,-6; 23 4,6; 24 3.2,6; 25 2.4,6; 26 1.6,6; 27 0.8,6; 28 0,6; 29 -0.8,6; 30 -1.6,6; 31 -2.4,6; 32 -3.2,6; 33 -4,6 | smd 1.8 x 0.5: 12 6,-4; 13 6,-3.2; 14 6,-2.4; 15 6,-1.6; 16 6,-0.8; 17 6,0; 18 6,0.8; 19 6,1.6; 20 6,2.4; 21 6,3.2; 22 6,4; 34 -6,4; 35 -6,3.2; 36 -6,2.4; 37 -6,1.6; 38 -6,0.8; 39 -6,0; 40 -6,-0.8; 41 -6,-1.6; 42 -6,-2.4; 43 -6,-3.2; 44 -6,-4
SOIC-8 = smd 0.711 x 1.778: 1 -1.905,-2.349; 2 -0.635,-2.349; 3 0.635,-2.349; 4 1.905,-2.349; 5 1.905,2.349; 6 0.635,2.349; 7 -0.635,2.349; 8 -1.905,2.349
BUS-TERMINAL-LAYOUT = smd 12.7 x 6.604: 1 0,0
PG-TO252-3-11 = smd 3.064 x 1.2: 1 5.918,-2.286; 2 5.918,0; 3 5.918,2.311 | smd 7.269 x 5.969: 4 -1.88,0
SMA = smd 2 x 2: A -2,0; C 2,0

### Placement (x,y rotation side)
C1  45.47,24.68 180 top
C2  58.67,19.61 270 top
C3  62.46,38.48 270 top
C4  45.47,37.08 180 top
C5  58.67,32 270 top
C6  93.85,32.11 270 top
C7  45.47,12.19 180 top
C8  58.67,7.11 270 top
C9  125.56,32.12 270 top
C10  35.81,28.7 0 top
C11  24.64,26.16 0 top
C12  41.66,17.53 270 top
C13  33.02,32 270 top
C17  20.07,51.31 270 top
C18  32.51,44.7 270 top
C19  37.08,49.14 180 top
C101  39.12,33.02 90 top
CON1  61.72,40.64 180 bottom
CON2  61.72,15.24 180 bottom
J1  2.13,32.61 90 top
JTAG1  33.27,8.13 270 top
OPTO1  12.95,7.11 270 top
OPTO2  12.95,26.92 270 top
OPTO3  12.95,36.83 270 top
OPTO4  12.95,46.74 270 top
OPTO5  12.95,17.02 270 top
OSC1  27.94,32.26 0 top
PWR  34.8,38.35 270 top
Q1  46.99,48.77 0 top
Q5  85.09,35.56 180 top
Q9  85.09,10.16 180 top
Q10  116.84,35.56 180 top
Q11  116.84,10.16 180 top
Q12  116.84,45.72 180 top
Q13  102.87,45.72 180 top
Q14  71.12,45.72 180 top
Q15  85.09,45.72 180 top
Q16  71.12,35.56 180 top
Q17  71.12,10.16 180 top
Q18  71.12,20.32 180 top
Q19  85.09,20.32 180 top
Q20  102.87,35.56 180 top
Q21  102.87,20.32 180 top
Q22  102.87,10.16 180 top
Q23  116.84,20.32 180 top
Q24  148.59,35.56 180 top
Q25  148.59,10.16 180 top
Q26  134.62,45.72 180 top
Q27  134.62,35.56 180 top
Q28  148.59,45.72 180 top
Q29  134.62,20.32 180 top
Q30  134.62,10.16 180 top
Q31  148.59,20.32 180 top
R1  118.36,2.03 180 top
R2  94.74,2.03 180 top
R3  102.62,2.03 180 top
R4  62.99,53.85 180 top
R5  78.74,53.85 180 top
R6  70.87,53.85 180 top
R7  110.49,53.85 0 top
R8  94.74,53.85 0 top
R9  102.62,53.85 0 top
R10  110.49,2.03 180 top
R11  86.61,2.03 180 top
R12  70.87,2.03 180 top
R13  62.99,2.03 180 top
R14  78.74,2.03 180 top
R15  22.86,32.26 270 top
R16  12.03,53.34 180 top
R17  20.07,5.42 90 top
R18  20.07,25.23 90 top
R19  20.07,35.14 90 top
R20  20.08,45.05 90 top
R21  20.07,15.33 90 top
R22  5.33,11.94 270 top
R23  5.33,30.23 90 top
R24  5.33,33.78 90 top
R25  5.59,42.93 90 top
R26  6.86,21.59 270 top
R27  23.88,15.49 90 top
R71  47.09,19.72 0 top
R72  46.99,34.29 0 top
R73  43.94,33.53 90 top
R74  46.99,29.97 180 top
R75  47.09,21.84 0 top
R76  43.92,21.11 90 top
R77  47.09,17.61 180 top
R78  50.04,25.04 90 top
R79  86.61,53.85 180 top
R80  50.05,37.53 90 top
R81  118.36,53.85 0 top
R83  46.99,32.13 0 top
R84  46.99,9.4 0 top
R85  43.94,8.64 90 top
R86  46.96,5.08 180 top
R87  50.04,12.7 90 top
R88  148.84,53.85 180 top
R89  134.37,2.03 180 top
R90  46.96,7.24 0 top
R91  126.49,53.85 180 top
R92  134.37,53.85 180 top
R93  142.24,53.85 180 top
R94  126.49,2.03 180 top
R95  148.84,2.03 180 top
R96  142.24,2.03 180 top
R100  45.72,42.16 0 top
R101  49.53,42.16 90 top
R102  35.56,42.16 0 top
SD1  55.88,46.48 270 top
SD5  55.12,25.21 180 top
SD6  55.12,37.59 180 top
SD7  55.12,12.7 180 top
STATUS  22.61,10.41 270 top
U1  32.26,20.83 0 top
U2  53.07,19.1 270 top
U4  53.09,31.57 270 top
U7  53.09,6.6 270 top
U-OUT  77.98,27.94 0 top
V-OUT  109.73,27.94 0 top
VR1  26.67,45.21 90 top
W-OUT  141.48,27.94 0 top
ZD1  39.88,41.4 90 top

### Tracks (layer width: path | path; a pad name or v marks a point on that pad's centre or on a via)
+3.3V  (via drill 0.38, 0.5, 0.6, 0.7)
  Top 0.406: U1.35 24.74,24.03 23.79,24.98 C11.1 23.37,26.58 v23.37,28.19 | C10.1 34.29,28.7 33.86,28.27 U1.26 33.86,24.97 31.5,22.61 v29.72,22.61 | C12.1 41.66,18.8 41.22,19.23 U1.15 35.74,19.23 v35.56,19.05
  Top 0.61: R20.2 20.08,47.05 17.85,49.28 | R19.2 20.07,37.16 17.85,39.37 OPTO3.6 | R21.2 20.07,17.34 17.85,19.56 | v22.86,29.72 R15.2 | OSC1.4 27.53,36.83 31.75,36.83 33.02,35.56 C13.1 34.38,32.85 v34.8,33.27 | R18.2 20.07,27.43 18.03,29.46 OPTO2.6 | OPTO1.6 17.85,9.4 18.67,9.4 19.3,8.76 19.3,7.62 20.07,6.86 R17.2
  Top 0.813: v25.65,6.86 JTAG1.6 | v14.73,9.65 OPTO1.6 | v14.73,29.46 OPTO2.6 | v14.73,39.37 OPTO3.6 | v14.73,19.56 OPTO5.6 17.85,19.56
  other vias: 17.53,52.07 22.35,52.07 15.24,52.07 15.24,49.28
  pour Route2: 13.46,0.51 44.2,0.51 44.2,29.97 36.32,29.97 36.32,35.05 27.43,35.05 27.43,37.59 21.34,37.59 21.34,53.34 13.46,53.34
  pour Top: 25.65,53.34 14.22,53.34 14.22,48.26 18.29,48.26 18.29,51.56 23.11,51.56 23.11,49.02 25.65,49.02
+9-36V  (via drill 0.38)
  Top 0.61: Q14.D4 Q14.D5
  Top 1.016: SD1.A 58.53,42.78 60.45,44.7 v65.02,44.7
  other vias: 90.93,33.02 78.99,33.02 78.99,34.54 78.99,36.58 90.93,34.54 90.93,36.58 90.93,38.1 78.99,43.18 78.99,44.7 78.99,46.74 78.99,48.26 90.93,42.93 90.93,44.45 90.93,46.74 76.96,38.1 76.96,36.58 76.96,34.54 76.96,33.02 76.96,43.18 76.96,44.7 76.96,46.74 76.96,48.26 65.02,43.18 65.02,46.74 65.02,48.26 65.02,34.54 65.02,36.58 65.02,33.02 96.77,33.02 96.77,34.54 96.77,36.58 108.71,33.02 108.71,34.54 108.71,36.58 108.71,38.1 96.77,43.18 96.77,44.7 96.77,46.74 96.77,48.26 108.71,46.74 108.71,44.7 108.71,43.18 108.71,48.26 90.93,48.26 110.74,46.74 110.74,48.26 110.74,44.7 110.74,43.18 122.68,43.18 122.68,44.7 122.68,46.74 122.68,48.26 110.74,36.58 110.74,34.54 110.74,33.02 122.68,33.02 122.68,34.54 122.68,36.58 122.68,38.1 128.52,44.7 128.52,43.18 140.46,43.18 140.46,44.7 140.46,46.74 140.46,48.26 128.52,46.74 128.52,48.26 128.52,34.54 128.52,36.58 128.52,33.02 140.46,33.02 140.46,34.54 140.46,36.58 140.46,38.1 142.49,46.74 142.49,48.26 154.43,48.26 154.43,46.74 154.43,44.7 154.43,43.18 142.49,44.7 142.49,43.18 154.43,38.1 154.43,36.58 154.43,34.54 154.43,33.02 142.49,33.02 142.49,34.54 142.49,36.58 142.49,38.1 128.52,38.1 110.74,38.1 96.77,38.1 78.99,38.1 65.02,38.1
  pour Top (isolate 0.254, rank 3): 61.72,55.63 61.72,30.73 161.04,30.73 161.04,49.53 154.94,49.53 154.94,55.63
  pour Bottom: 154.94,55.63 61.72,55.63 61.72,28.45 161.04,28.45 161.04,49.53 154.94,49.53
+12V-PROTECTED  (via drill 0.7)
  Top 0.406: C1.1 46.87,24.19 | C4.1 46.87,36.68 | C7.1 47.21,11.85 | Q1.3 49.61,45.97 | R101.2 49.87,43.01
  Top 0.61: R87.1 50.04,11.43 51.31,10.16 51.82,10.16 52.58,9.4 52.58,7.37 53.59,6.35 53.59,5.08 53.98,4.7 U7.5 | R78.1 50.04,23.88 51.31,22.61 51.82,22.61 52.58,21.84 52.58,19.81 53.59,18.8 53.59,17.53 53.92,17.2 U2.5 | R80.1 50.05,36.31 51.31,35.05 51.82,35.05 52.58,34.29 52.58,32.26 53.59,31.24 53.59,30.23 54.15,29.67 U4.5
  Top 0.813: 46.87,24.19 R78.1 | 46.87,36.68 R80.1 | 47.21,11.85 R87.1 | Q1.3 49.53,45.44 R101.2 | 49.61,45.97 50.8,45.97 v51.05,45.72 | 49.87,43.01 v51.05,44.2 | R102.2 36.41,40.55 v36.83,40.13 | C101.+ 37.25,37.34 v36.83,37.34 | v46.99,39.62 46.99,37.21 C4.1 | v46.23,27.18 46.87,26.54 C1.1 | v45.97,14.73 45.97,14.22 46.87,13.33 C7.1
  pour Route2: 45.21,0.51 56.9,0.51 56.9,53.09 31.5,53.09 31.5,36.07 37.08,36.07 37.08,30.73 45.21,30.73
EN_IN
  Top 0.406: J1.6 2.52,28.45 5.33,28.45 6.86,26.92 R26.1
ENABLE
  Top 0.406: R21.1 20.83,14.48 21.59,15.24 21.59,18.03 23.58,20.03 U1.40
  Top 0.61: R21.1 OPTO5.4
GND  (via drill 0.38, 0.5, 0.6, 0.7)
  Top 0.406: U1.4 30.66,17.45 v30.73,17.53 | v35.56,20.83 U1.17 | 43.3,36.32 C4.2 | R101.1 49.7,41.15 | C7.2 43.94,12.32 | U1.25 34.66,24.5 31.24,21.08 v29.72,21.08 | R77.1 47.94,14.92 v47.75,14.73 | C11.2 25.4,26.25 v25.4,27.69 | R74.1 47.84,27.6 v48.26,27.18 | R86.1 47.81,3.75 48.51,3.05 v49.28,3.05 | STATUS.C 22.61,6.1 23.62,5.08 27.08,5.08 JTAG1.5
  Top 0.61: v33.02,29.72 C13.2 31.81,31.15 OSC1.2 | R16.1 12.88,47.83 13.97,46.74 v14.73,46.74 | VR1.4 VR1.2 | C18.2 31.15,43.85 | 30.99,43.69 v30.99,44.45 | U4.3 49.73,30.94 49.28,30.48 49.28,28.19 v48.26,27.18 | U2.3 49.71,18.47 49.28,18.03 49.28,16.26 v47.75,14.73 | U7.3 49.66,5.97 49.28,5.59 v49.28,3.05
  Top 0.813: v42.16,36.32 43.3,36.32 | 49.7,41.15 v51.31,41.15 | JTAG1.5 v28.19,9.65 | C19.- 40.63,46.49 v40.89,46.23 | C17.2 21.97,48.01 21.97,46.87 v22.35,46.48 | C12.2 41.66,14.99 v41.91,14.73 | v41.66,21.08 42.16,21.08 42.99,20.26 R76.1 | 43.94,12.32 v43.94,14.73 | R85.1 42.25,7.79 v42.16,7.87 | C1.2 44.07,27.05 v43.94,27.18 | R73.1 43.94,32 v42.93,30.99 | ZD1.A 41.43,37.85 v42.16,37.85 | C10.2 38.1,27.27 v38.1,26.92 | v40.39,26.92 40.39,29.3 C101.- | PWR.C 34.8,35.05 v34.54,34.8 | v93.98,27.18 93.98,30.58 C6.2 | C9.2 125.73,30.55 125.73,29.97 126.49,29.21 v126.49,28.45 | C3.2 62.46,36.3 v60.96,34.8 | v14.73,7.11 OPTO1.5 | v14.73,26.92 OPTO2.5 | v14.73,36.83 OPTO3.5 | v14.73,46.74 OPTO4.5 | v14.73,17.02 OPTO5.5 | 31.15,43.85 30.99,43.69
  Route3 0.813: 126.49,27.18 v126.49,28.45
  Bottom 0.813: v126.49,28.45 126.49,27.18
  other vias: 69.6,22.35 70.87,22.35 72.14,22.35 73.41,22.35 68.33,18.29 69.6,18.29 70.87,18.29 72.14,18.29 82.3,22.35 83.57,22.35 84.84,22.35 86.11,22.35 87.38,22.35 82.3,18.29 83.57,18.29 84.84,18.29 86.11,18.29 114.05,22.35 115.32,22.35 116.59,22.35 117.86,22.35 119.13,22.35 114.05,18.29 115.32,18.29 116.59,18.29 117.86,18.29 101.35,22.35 102.62,22.35 103.89,22.35 105.16,22.35 100.08,18.29 101.35,18.29 102.62,18.29 103.89,18.29 68.33,12.19 69.6,12.19 70.87,12.19 72.14,12.19 73.41,12.19 68.33,8.13 69.6,8.13 70.87,8.13 72.14,8.13 82.3,12.19 83.57,12.19 84.84,12.19 86.11,12.19 87.38,12.19 82.3,8.13 83.57,8.13 84.84,8.13 86.11,8.13 100.08,12.19 101.35,12.19 102.62,12.19 103.89,12.19 105.16,12.19 100.08,8.13 101.35,8.13 102.62,8.13 103.89,8.13 114.05,12.19 115.32,12.19 116.59,12.19 117.86,12.19 119.13,12.19 114.05,8.13 115.32,8.13 116.59,8.13 117.86,8.13 133.1,22.35 134.37,22.35 135.64,22.35 136.91,22.35 131.83,18.29 133.1,18.29 134.37,18.29 135.64,18.29 145.8,22.35 147.07,22.35 148.34,22.35 149.61,22.35 150.88,22.35 145.8,18.29 147.07,18.29 148.34,18.29 149.61,18.29 150.88,12.19 149.61,12.19 148.34,12.19 147.07,12.19 145.8,12.19 145.8,8.13 147.07,8.13 148.34,8.13 149.61,8.13 131.83,12.19 133.1,12.19 134.37,12.19 135.64,12.19 136.91,12.19 131.83,8.13 133.1,8.13 134.37,8.13 135.64,8.13 22.35,44.45 30.99,46.48 24.64,38.35 28.7,38.35 22.35,38.35 30.99,40.39 30.99,42.42 26.67,38.35 68.33,22.35 100.08,22.35 22.35,40.39 22.35,42.42 30.99,38.35 131.83,22.35
  pour Route3: 13.97,55.63 62.48,55.63 62.48,27.43 157.23,27.43 157.23,0.51 13.97,0.51
  pour Top: 21.84,46.99 31.5,46.99 31.5,37.85 21.84,37.85
  pour Bottom: 61.72,27.43 61.72,0.25 154.94,0.25 154.94,6.35 161.04,6.35 161.04,27.43
  pour Bottom: 18.29,51.05 35.05,51.05 35.05,34.29 18.29,34.29
  pour Top (isolate 0.254): 67.82,23.11 74.17,23.11 74.17,17.53 67.82,17.53
  pour Top (isolate 0.254): 81.79,23.11 88.14,23.11 88.14,17.53 81.79,17.53
  pour Top (isolate 0.254): 67.82,12.95 74.17,12.95 74.17,7.37 67.82,7.37
  pour Top (isolate 0.254): 81.79,12.95 88.14,12.95 88.14,7.37 81.79,7.37
  pour Top (isolate 0.254): 99.57,23.11 105.92,23.11 105.92,17.53 99.57,17.53
  pour Top (isolate 0.254): 99.57,12.95 105.92,12.95 105.92,7.37 99.57,7.37
  pour Top (isolate 0.254): 113.54,12.95 119.89,12.95 119.89,7.37 113.54,7.37
  pour Top (isolate 0.254): 113.54,23.11 119.89,23.11 119.89,17.53 113.54,17.53
  pour Top (isolate 0.254): 131.32,23.11 137.67,23.11 137.67,17.53 131.32,17.53
  pour Top (isolate 0.254): 131.32,12.95 137.67,12.95 137.67,7.37 131.32,7.37
  pour Top (isolate 0.254): 145.29,12.95 151.64,12.95 151.64,7.37 145.29,7.37
  pour Top (isolate 0.254): 145.29,23.11 151.64,23.11 151.64,17.53 145.29,17.53
GND_GFE  (via drill 0.5)
  Top 0.61: R16.2 9.91,53.34 v9.4,52.83 | OPTO1.2 v11.18,7.11 | OPTO2.2 v11.18,26.92 | OPTO3.2 v11.18,36.83 | OPTO4.2 v11.18,46.74 | OPTO5.2 v11.18,17.02 | J1.5 3.86,38.15 v5.33,39.62 v5.33,40.89
  pour Route3: 11.68,0.51 11.68,55.63 0.51,55.63 0.51,0.51
N$1  (via drill 0.6)
  Top 0.61: v87.38,8.38 87.38,9.97 Q9.G | R14.1 80.52,2.03 v81.28,2.79
  Route2 0.61: v81.28,2.79 83.31,4.83 86.36,4.83 87.38,5.84 v87.38,8.38
N$2  (via drill 0.6)
  Top 0.61: R13.1 64.77,2.03 v65.53,2.79 | v73.66,8.38 73.66,9.72 Q17.G
  Route2 0.61: v65.53,2.79 67.56,4.83 71.88,4.83 73.66,6.6 v73.66,8.38
N$3  (via drill 0.6)
  Top 0.61: v73.41,18.54 73.41,20.13 Q18.G | R12.1 72.64,2.03 v73.41,2.79
  Route2 0.61: v73.41,2.79 75.44,4.83 75.44,14.99 73.41,17.02 v73.41,18.54
N$4
  Top 0.406: R83.2 47.92,32.21
  Top 0.61: 47.92,32.21 U4.2
N$5  (via drill 0.6)
  Top 0.61: v87.38,18.54 87.38,20.13 Q19.G | R11.1 88.39,2.03 v89.15,2.79
  Route2 0.61: v89.15,2.79 89.41,3.05 89.41,14.99 87.38,17.02 v87.38,18.54
N$6
  Top 0.406: JTAG1.1 37.08,7.47 37.08,12.19 35.46,13.82 U1.10
N$7  (via drill 0.6)
  Top 0.61: v87.38,37.34 87.38,35.75 Q5.G | R79.1 88.39,53.85 v89.15,53.09
  Route2 0.61: v89.15,53.09 89.41,52.83 89.41,40.89 87.38,38.86 v87.38,37.34
N$8  (via drill 0.6)
  Top 0.61: v119.13,37.34 119.13,35.75 Q10.G | R81.2 120.14,53.85 v120.9,53.09
  Route2 0.61: v120.9,53.09 121.16,52.83 121.16,40.89 119.13,38.86 v119.13,37.34
N$9
  Top 0.406: R71.2 47.95,19.74
  Top 0.61: 47.95,19.74 U2.2
N$10  (via drill 0.6)
  Top 0.61: v119.13,8.38 119.13,9.97 Q11.G | R10.1 112.27,2.03 v113.03,2.79
  Route2 0.61: v119.13,8.38 119.13,5.84 118.11,4.83 115.06,4.83 v113.03,2.79
N$11  (via drill 0.6)
  Top 0.61: v119.13,47.5 119.13,45.91 Q12.G | R7.2 112.27,53.85 v113.03,53.09
  Route2 0.61: v113.03,53.09 115.06,51.05 118.11,51.05 119.13,50.04 v119.13,47.5
N$12
  Top 0.406: R22.2 6.97,9.65 OPTO1.1
N$13  (via drill 0.6)
  Top 0.61: v136.91,47.5 136.91,45.91 Q26.G | R91.1 128.27,53.85 v129.03,53.09
  Route2 0.61: v129.03,53.09 131.06,51.05 135.89,51.05 136.91,50.04 v136.91,47.5
N$14
  Top 0.406: U2.8
  Top 0.61: U2.8 C2.1
  Top 1.778: C2.1 58.67,23.84 SD5.C
N$15  (via drill 0.6)
  Top 0.61: v105.16,47.5 105.16,45.91 Q13.G | R8.2 96.52,53.85 v97.28,53.09
  Route2 0.61: v97.28,53.09 99.31,51.05 103.89,51.05 105.16,49.78 v105.16,47.5
N$16  (via drill 0.6)
  Top 0.61: v136.91,37.34 136.91,35.75 Q27.G | R92.1 136.14,53.85 v136.91,53.09
  Route2 0.61: v136.91,53.09 138.94,51.05 138.94,40.89 136.91,38.86 v136.91,37.34
N$17
  Top 0.813: R78.2 52.17,25.89 SD5.A
N$18
  Top 0.61: R75.2 48.78,21.01 U2.1
N$19  (via drill 0.6)
  Top 0.61: R12.2 68.58,2.03 v68.33,1.78 | R14.2 76.45,2.03 v76.2,1.78 | R11.2 84.33,2.03 v84.07,1.78 | v59.44,3.3 60.71,2.03 R13.2 | U2.4 50.72,15.67 v50.55,15.49
  Route2 0.61: v84.07,1.78 83.82,1.52 76.45,1.52 v76.2,1.78 75.95,1.52 68.58,1.52 v68.33,1.78 68.07,1.52 60.71,1.52 59.44,2.79 v59.44,3.3
  Bottom 0.61: v50.55,15.49 50.55,9.65 51.82,8.38 54.36,8.38 v59.44,3.3
N$20  (via drill 0.6)
  Top 0.61: v150.88,47.5 150.88,45.91 Q28.G | R93.1 144.02,53.85 v144.78,53.09
  Route2 0.61: v144.78,53.09 145.8,52.07 147.57,52.07 150.88,48.77 v150.88,47.5
N$21  (via drill 0.6)
  Top 0.61: v150.88,37.34 150.88,35.75 Q24.G | R88.1 150.62,53.85 v151.38,53.09
  Route2 0.61: v151.38,53.09 151.38,50.55 152.91,49.02 152.91,40.89 150.88,38.86 v150.88,37.34
N$22
  Top 0.406: 58.6,33.48 C5.1
  Top 0.61: U4.8 58.6,33.48
  Top 1.778: C5.1 58.67,36.22 SD6.C
N$23
  Top 0.406: R23.2 5.48,30.73 7.11,30.73 8.31,29.54 OPTO2.1
N$24  (via drill 0.6)
  Top 0.61: v105.16,37.34 105.16,35.75 Q20.G | R9.2 104.39,53.85 v105.16,53.09
  Route2 0.61: v105.16,53.09 107.19,51.05 107.19,40.64 105.16,38.61 v105.16,37.34
N$25
  Top 0.813: R80.2 52.86,38.38 SD6.A
N$26
  Top 0.61: R72.2 48.65,33.48 U4.1
N$27  (via drill 0.6)
  Top 0.61: U4.4 50.74,28.13 v50.55,27.94 | R3.2 100.33,2.03 v100.08,1.78 | R10.2 108.2,2.03 v107.95,1.78 | R1.2 116.08,2.03 v115.82,1.78 | R2.2 92.46,2.03 v92.2,1.78
  Route2 0.61: v115.82,1.78 115.57,1.52 108.2,1.52 v107.95,1.78 107.7,1.52 100.33,1.52 v100.08,1.78 99.82,1.52 92.46,1.52 v92.2,1.78 92.2,1.52
  Route3 0.61: v57.4,3.3 58.67,4.57 59.94,4.57 61.98,2.54 63.5,2.54 65.02,4.06 66.04,4.06 67.06,3.05 71.88,3.05 72.9,4.06 73.91,4.06 74.93,3.05 79.76,3.05 80.77,4.06 81.79,4.06 82.8,3.05 87.63,3.05 88.65,4.06 89.66,4.06 90.42,3.3 90.42,2.03 90.93,1.52 91.95,1.52 v92.2,1.78
  Bottom 0.61: v50.55,27.94 50.55,25.91 49.02,24.38 49.02,6.35 52.58,2.79 56.9,2.79 v57.4,3.3
N$28  (via drill 0.6)
  Top 0.61: v150.88,8.38 150.88,9.97 Q25.G | R96.1 144.02,2.03 v144.78,2.79
  Route2 0.61: v150.88,8.38 150.88,7.37 147.07,3.56 145.54,3.56 v144.78,2.79
N$29
  Top 0.61: R90.2 U7.2
N$30  (via drill 0.6)
  Top 0.61: v136.91,18.54 136.91,20.13 Q29.G | R89.1 136.14,2.03 v136.91,2.79
  Route2 0.61: v136.91,18.54 136.91,17.02 138.94,14.99 138.94,4.83 v136.91,2.79
N$31
  Top 0.406: C8.1
  Top 0.61: U7.8 C8.1
  Top 1.778: C8.1 58.67,11.33 SD7.C
N$32  (via drill 0.6)
  Top 0.61: R91.2 124.21,53.85 v123.95,54.1 | R92.2 132.08,53.85 v131.83,54.1 | R93.2 139.95,53.85 v139.7,54.1 | R88.2 146.56,53.85 v146.3,54.1 | U7.7 54.23,7.24 53.85,7.62 v53.85,9.91
  Route2 0.61: v123.95,54.1 124.21,54.36 131.57,54.36 v131.83,54.1 132.08,54.36 139.45,54.36 v139.7,54.1 139.95,54.36 146.05,54.36 v146.3,54.1
  Bottom 0.61: v123.95,54.1 123.7,54.36 117.86,54.36 116.33,52.83 115.32,52.83 113.79,54.36 109.98,54.36 108.46,52.83 107.44,52.83 105.92,54.36 102.11,54.36 100.58,52.83 99.57,52.83 98.04,54.36 94.23,54.36 92.71,52.83 91.69,52.83 90.17,54.36 86.11,54.36 84.58,52.83 83.57,52.83 82.04,54.36 78.23,54.36 76.71,52.83 75.69,52.83 74.17,54.36 70.36,54.36 68.83,52.83 67.82,52.83 66.29,54.36 59.18,54.36 53.09,48.26 53.09,38.1 50.55,35.56 50.55,30.73 52.07,29.21 52.07,24.89 50.55,23.37 50.55,18.03 52.07,16.51 52.07,12.19 53.85,10.41 v53.85,9.91
N$33  (via drill 0.6)
  Top 0.61: v136.91,8.38 136.91,9.97 Q30.G | R94.1 128.27,2.03 v129.03,2.79
  Route2 0.61: v136.91,8.38 136.91,5.84 135.89,4.83 131.06,4.83 v129.03,2.79
N$34
  Top 0.406: 52.01,13.55 SD7.A
  Top 0.813: R87.2 52.01,13.55
N$35
  Top 0.61: U7.1 48.73,8.51 R84.2
N$36  (via drill 0.6)
  Top 0.61: v123.95,1.78 124.21,2.03 R94.2 | R89.2 132.08,2.03 v131.83,1.78 | R96.2 139.95,2.03 v139.7,1.78 | R95.2 146.56,2.03 v146.3,1.78 | U7.4 53.4,2.03 v58.42,2.03
  Route2 0.61: v123.95,1.78 124.21,1.52 131.57,1.52 v131.83,1.78 132.08,1.52 139.45,1.52 v139.7,1.78 139.95,1.52 146.05,1.52 v146.3,1.78
  Bottom 0.61: v58.42,2.03 60.2,2.03 60.71,1.52 66.29,1.52 67.82,3.05 68.83,3.05 70.36,1.52 74.17,1.52 75.69,3.05 76.71,3.05 78.23,1.52 82.04,1.52 83.57,3.05 84.58,3.05 86.11,1.52 90.42,1.52 91.95,3.05 92.96,3.05 94.49,1.52 98.04,1.52 99.57,3.05 100.58,3.05 102.11,1.52 105.92,1.52 107.44,3.05 108.46,3.05 109.98,1.52 113.79,1.52 115.32,3.05 116.33,3.05 117.86,1.52 123.7,1.52 v123.95,1.78
N$37  (via drill 0.6)
  Top 0.61: v150.88,18.54 150.88,20.13 Q31.G | R95.1 150.62,2.03 v151.38,2.79
  Route2 0.61: v150.88,18.54 150.88,17.02 152.91,14.99 152.91,7.11 151.38,5.59 v151.38,2.79
N$38  (via drill 0.6)
  Top 0.61: v105.16,18.54 105.16,20.13 Q21.G | R3.1 104.39,2.03 v105.16,2.79
  Route2 0.61: v105.16,18.54 105.16,17.02 107.19,14.99 107.19,4.83 v105.16,2.79
N$39  (via drill 0.6)
  Top 0.61: v105.16,8.38 105.16,9.97 Q22.G | R2.1 96.52,2.03 v97.28,2.79
  Route2 0.61: v105.16,8.38 105.16,5.84 104.14,4.83 99.31,4.83 v97.28,2.79
N$40  (via drill 0.6)
  Top 0.61: v119.13,18.54 119.13,20.13 Q23.G | R1.1 120.14,2.03 v120.9,2.79
  Route2 0.61: v119.13,18.54 119.13,17.02 121.16,14.99 121.16,3.05 v120.9,2.79
N$41  (via drill 0.6)
  Top 0.61: v73.41,47.5 73.41,45.91 Q14.G | R4.1 64.77,53.85 v65.53,53.09
  Route2 0.61: v65.53,53.09 67.56,51.05 72.14,51.05 73.41,49.78 v73.41,47.5
N$42  (via drill 0.6)
  Top 0.61: v87.38,47.5 87.38,45.91 Q15.G | R5.1 80.52,53.85 v81.28,53.09
  Route2 0.61: v81.28,53.09 83.31,51.05 86.11,51.05 87.38,49.78 v87.38,47.5
N$43  (via drill 0.6)
  Top 0.61: v73.41,37.34 73.41,35.75 Q16.G | R6.1 72.64,53.85 v73.41,53.09
  Route2 0.61: v73.41,53.09 75.44,51.05 75.44,40.89 73.41,38.86 v73.41,37.34
N$44
  Top 0.406: R24.2 5.33,34.54 6.86,36.07 6.86,37.92 OPTO3.1
N$45
  Top 0.406: R25.2 5.59,47.5 6.86,48.77 7.8,48.77 OPTO4.1
N$46  (via drill 0.38, 0.6)
  Top 0.61: v92.2,54.1 92.46,53.85 R8.1 | R9.1 100.33,53.85 v100.08,54.1 | R7.1 108.2,53.85 v107.95,54.1 | R81.1 116.08,53.85 v115.82,54.1 | U4.7 54.15,32.21 53.85,32.51 v53.85,34.8
  Route2 0.61: v92.2,54.1 91.95,54.36 | v92.2,54.1 92.46,54.36 99.82,54.36 v100.08,54.1 100.33,54.36 107.7,54.36 v107.95,54.1 108.2,54.36 115.57,54.36 v115.82,54.1 | v53.85,34.8 54.61,35.56 56.39,35.56 57.4,36.58 57.4,48.77 59.69,51.05 v60.71,51.05 | v92.2,54.1 91.95,54.1
  Route3 0.61: v60.71,51.05 61.47,51.82 61.47,52.58 62.23,53.34 63.25,53.34 64.77,51.82 66.04,51.82 67.06,52.83 71.88,52.83 72.9,51.82 73.91,51.82 74.93,52.83 79.76,52.83 80.77,51.82 81.79,51.82 82.8,52.83 87.63,52.83 88.65,51.82 89.66,51.82 90.42,52.58 90.42,53.85 90.93,54.36 91.69,54.36 91.95,54.1 v92.2,54.1
N$47  (via drill 0.6)
  Top 0.61: R6.2 68.58,53.85 v68.33,54.1 | R4.2 60.45,53.85 v59.69,53.09 | R5.2 76.45,53.85 v76.2,54.1 | R79.2 84.33,53.85 v84.07,54.1 | U2.7 54.18,19.74 53.85,20.07 v53.85,22.35
  Route2 0.61: v84.07,54.1 83.82,54.36 76.45,54.36 v76.2,54.1 75.95,54.36 68.58,54.36 v68.33,54.1 68.07,54.36 60.96,54.36 v59.69,53.09
  Bottom 0.61: 59.44,52.83 v59.69,53.09 56.64,50.04 56.64,30.99 53.85,28.19 v53.85,22.35
N$48
  Top 0.406: R26.2 6.86,20.07 7.37,19.56 OPTO5.1
N$49
  Top 0.406: R27.1 23.88,14.22 22.61,12.95 STATUS.A
N$50
  Top 0.406: U1.42 24.52,18.43 23.88,17.78 R27.2
N$59
  Top 0.406: JTAG1.2 34.66,11.24 U1.9
N$60
  Top 0.406: JTAG1.3 33.27,11.43 31.75,12.95 27.18,12.95 26.67,13.46 26.67,15.24 35.46,24.03 U1.24
N$61
  Top 0.406: JTAG1.4 30.73,4.83 32,3.56 39.37,3.56 40.39,4.57 40.39,11.43 39.12,12.7 37.85,12.7 36.26,14.29 U1.11
N$62
  Top 0.406: R100.1 44.68,42.52
  Top 0.813: 44.68,42.52 Q1.1 | ZD1.C 41.12,42.16 R100.1
N$63
  Top 0.813: R102.1 34.71,39.86 PWR.A
N$65
  Top 0.61: OSC1.1 25.41,31.49 23.79,33.11 R15.1
N$72
  Top 0.406: U1.43 28.04,17.63 28.7,18.29 28.7,24.38 27.18,25.91 27.18,28.45 28.7,29.97 28.7,32.92 OSC1.3
N$100
  Top 0.406: R100.2 46.99,42.29
  Top 0.813: 46.99,42.29 Q1.2 | C19.+ 33.53,46.83 32.51,45.81 C18.1
  pour Top (no thermals): 27.69,53.34 58.42,53.34 58.42,48.01 48.01,48.01 48.01,44.2 45.97,44.2 45.97,48.01 43.69,48.01 43.69,50.8 37.08,50.8 37.08,47.87 30.99,47.87 30.99,49.02 27.69,49.02
PWM1_IN
  Top 0.406: J1.1 3.91,27.08 5.84,25.15 5.84,13.46 5.33,12.95 R22.1
PWM2_IN
  Top 0.406: J1.2 2.63,29.72 4.32,29.72 4.46,29.58 R23.1
PWM3_IN
  Top 0.406: J1.3 4.82,32.61 R24.1
PWM_U_H
  Top 0.406: 44.03,21.84 R76.2 43.52,22.35 40.13,22.35 39.41,21.63 U1.18
  Top 0.813: 44.03,21.84 R75.1
PWM_U_L
  Top 0.406: 46.24,18.67 43.18,18.67 41.82,20.03 U1.16
  Top 0.813: R77.2 46.24,18.67 R71.1
PWM_V_H
  Top 0.406: 43.94,34.29 R73.2 42.51,34.38 41.66,33.53 41.66,25.91 40.58,24.83 U1.22
  Top 0.61: 43.94,34.29 R72.1
PWM_V_L
  Top 0.406: U1.20 41.77,23.23 42.67,24.13 42.67,28.96 44.77,31.05 46.14,31.05
  Top 0.813: R74.2 46.14,31.05 R83.1
PWM_W_H
  Top 0.406: 46.05,9.49 R84.1 | R85.2 42.33,9.49 41.91,9.91 41.91,11.94 40.64,13.21 40.64,16.76 40.13,17.27 40.13,17.78 39.48,18.43 U1.14
  Top 0.813: R85.2 46.05,9.49
PWM_W_L
  Top 0.406: 46.12,6.16 41.85,6.16 41.15,6.86 41.15,11.68 39.88,12.95 39.88,16.26 39.31,16.83 U1.12
  Top 0.813: R86.2 46.12,6.16 R90.1
SW1_INPUT
  Top 0.406: U1.41 24.05,19.23 22.35,17.53 22.35,14.22 20.83,12.7 20.83,7.87 21.59,7.11 21.59,5.33 20.83,4.57 R17.1
  Top 0.61: OPTO1.4 R17.1
SW2_INPUT
  Top 0.406: U1.39 24.38,20.83 20.83,24.39 R18.1
  Top 0.61: OPTO2.4 R18.1
  Top 0.813: R18.1
SW3_INPUT
  Top 0.406: U1.38 24.6,21.63 21.34,24.89 21.34,27.69 20.07,28.96 R19.1
  Top 0.61: R19.1 OPTO3.4
U_OUTPUT  (via drill 0.38, 0.5)
  Top 0.406: 66.38,18.21 Q18.D4 | 58.42,18.47 C2.2
  Top 0.61: U2.6 58.42,18.47
  Top 0.813: C2.2 66.38,18.21
  other vias: 68.33,33.53 68.33,37.59 70.87,33.53 69.6,33.53 70.87,37.59 69.6,37.59 73.41,33.53 72.14,33.53 72.14,37.59 68.33,43.69 68.33,47.75 70.87,43.69 69.6,43.69 83.57,33.53 82.3,33.53 70.87,47.75 69.6,47.75 73.41,43.69 72.14,43.69 86.11,33.53 84.84,33.53 83.57,37.59 82.3,37.59 72.14,47.75 87.38,33.53 86.11,37.59 84.84,37.59 83.57,43.69 82.3,43.69 86.11,43.69 84.84,43.69 83.57,47.75 82.3,47.75 87.38,43.69 86.11,47.75 84.84,47.75 65.02,22.86 65.02,21.34 65.02,19.3 65.02,17.78 76.96,17.78 76.96,19.3 76.96,21.34 76.96,22.86 78.99,22.86 78.99,21.34 78.99,19.3 78.99,17.78 90.93,22.86 90.93,21.34 90.93,17.78 90.93,19.3 65.02,12.7 65.02,11.18 65.02,9.14 65.02,7.62 76.96,11.18 76.96,9.14 76.96,7.62 78.99,12.7 78.99,11.18 78.99,9.14 78.99,7.62 90.93,11.18 90.93,9.14 90.93,7.62 90.93,12.7 76.96,12.7
  pour Route2: 61.98,53.34 93.47,53.59 93.47,2.29 61.98,2.03
  pour Route3: 63.5,28.45 93.47,28.45 93.47,55.63 63.5,55.63
  pour Top (isolate 0.254, rank 2): 61.72,0.25 93.47,0.25 93.47,31.75 88.14,31.75 88.14,48.26 81.79,48.26 81.79,31.75 74.17,31.75 74.17,48.26 67.82,48.26 67.82,31.75 61.72,31.75
V_OUTPUT  (via drill 0.38, 0.5, 0.6)
  Top 0.406: 58.34,30.94 C5.2
  Top 0.61: U4.6 58.34,30.94
  Top 0.813: C5.2 59.31,29.97 v60.96,29.97
  Route3 0.813: v60.96,29.97 62.48,28.45 97.54,28.45 100.08,30.99 v100.08,33.53
  other vias: 100.08,47.75 101.35,47.75 102.62,47.75 103.89,47.75 100.08,43.69 101.35,43.69 102.62,43.69 103.89,43.69 105.16,43.69 100.08,37.59 101.35,37.59 102.62,37.59 103.89,37.59 101.35,33.53 102.62,33.53 103.89,33.53 105.16,33.53 114.05,47.75 115.32,47.75 116.59,47.75 117.86,47.75 119.13,43.69 117.86,43.69 116.59,43.69 115.32,43.69 114.05,43.69 114.05,37.59 115.32,37.59 116.59,37.59 117.86,37.59 114.05,33.53 115.32,33.53 116.59,33.53 117.86,33.53 119.13,33.53 96.77,22.86 96.77,21.34 96.77,19.3 96.77,17.78 108.71,17.78 108.71,19.3 108.71,21.34 108.71,22.86 96.77,12.7 96.77,11.18 96.77,9.14 96.77,7.62 108.71,11.18 108.71,9.14 108.71,7.62 110.74,17.78 110.74,19.3 110.74,21.34 110.74,22.86 122.68,17.78 122.68,19.3 122.68,21.34 122.68,22.86 110.74,7.62 110.74,9.14 110.74,11.18 110.74,12.7 122.68,7.62 122.68,9.14 122.68,11.18 108.71,12.7 122.68,12.7
  pour Route2: 94.23,2.29 125.22,2.29 125.22,53.59 94.23,53.59
  pour Route3: 94.23,28.45 125.22,28.45 125.22,55.63 94.23,55.63
  pour Top (isolate 0.254, rank 2): 94.23,0.25 125.22,0.25 125.22,31.75 119.89,31.75 119.89,48.26 113.54,48.26 113.54,31.75 105.92,31.75 105.92,48.26 99.57,48.26 99.57,31.75 94.23,31.75
W_OUTPUT  (via drill 0.38, 0.5, 0.6)
  Top 0.406: 58.42,5.97 C8.2
  Top 0.61: U7.6 58.42,5.97 | C8.2 59.81,5.71 v60.96,6.86
  Route2 0.813: v124.71,28.45 124.71,29.21 125.22,29.72 126.24,29.72
  Bottom 0.813: v60.96,6.86 60.96,7.11 58.67,9.4 58.67,27.43 59.69,28.45 v124.71,28.45
  other vias: 131.83,47.75 133.1,47.75 134.37,47.75 135.64,47.75 131.83,43.69 133.1,43.69 134.37,43.69 135.64,43.69 136.91,43.69 131.83,37.59 133.1,37.59 134.37,37.59 135.64,37.59 131.83,33.53 133.1,33.53 134.37,33.53 135.64,33.53 136.91,33.53 145.8,47.75 147.07,47.75 148.34,47.75 149.61,47.75 145.8,43.69 147.07,43.69 148.34,43.69 149.61,43.69 150.88,43.69 145.8,37.59 147.07,37.59 148.34,37.59 149.61,37.59 145.8,33.53 147.07,33.53 148.34,33.53 149.61,33.53 150.88,33.53 128.52,12.7 128.52,11.18 128.52,9.14 128.52,22.86 128.52,21.34 128.52,19.3 128.52,17.78 140.46,22.86 140.46,21.34 140.46,17.78 140.46,12.7 140.46,11.18 140.46,9.14 140.46,7.62 140.46,19.3 142.49,9.14 142.49,7.62 142.49,11.18 142.49,12.7 154.43,12.7 154.43,11.18 154.43,9.14 154.43,7.62 142.49,21.34 142.49,22.86 154.43,22.86 154.43,21.34 154.43,19.3 154.43,17.78 142.49,19.3 142.49,17.78 128.52,7.62
  pour Route2: 125.98,2.29 157.23,2.29 157.23,53.59 125.98,53.59
  pour Route3: 125.98,28.45 157.23,28.45 157.23,55.63 125.98,55.63
  pour Top (isolate 0.254, rank 2): 125.98,0.25 154.94,0.25 154.94,6.35 161.04,6.35 161.04,31.75 151.64,31.75 151.64,48.26 145.29,48.26 145.29,31.75 137.67,31.75 137.67,48.26 131.32,48.26 131.32,31.75 125.98,31.75
WATCHDOG
  Top 0.406: U1.37 24.82,22.43 22.1,25.15 22.1,28.19 21.34,28.96 21.34,37.34 20.08,38.59 R20.1
  Top 0.61: R20.1 OPTO4.4
WATCHDOG_IN
  Top 0.406: J1.4 4.39,35.38 5.84,36.83 5.84,38.35 6.6,39.12 6.6,41.26 R25.1

### Text on the board
tPlace: Designed By: DK, RG - 2011 | Motor Driver V 1.0